# Altium project Prototype_2_Main_Board.PrjPcb (part 1 of 2)
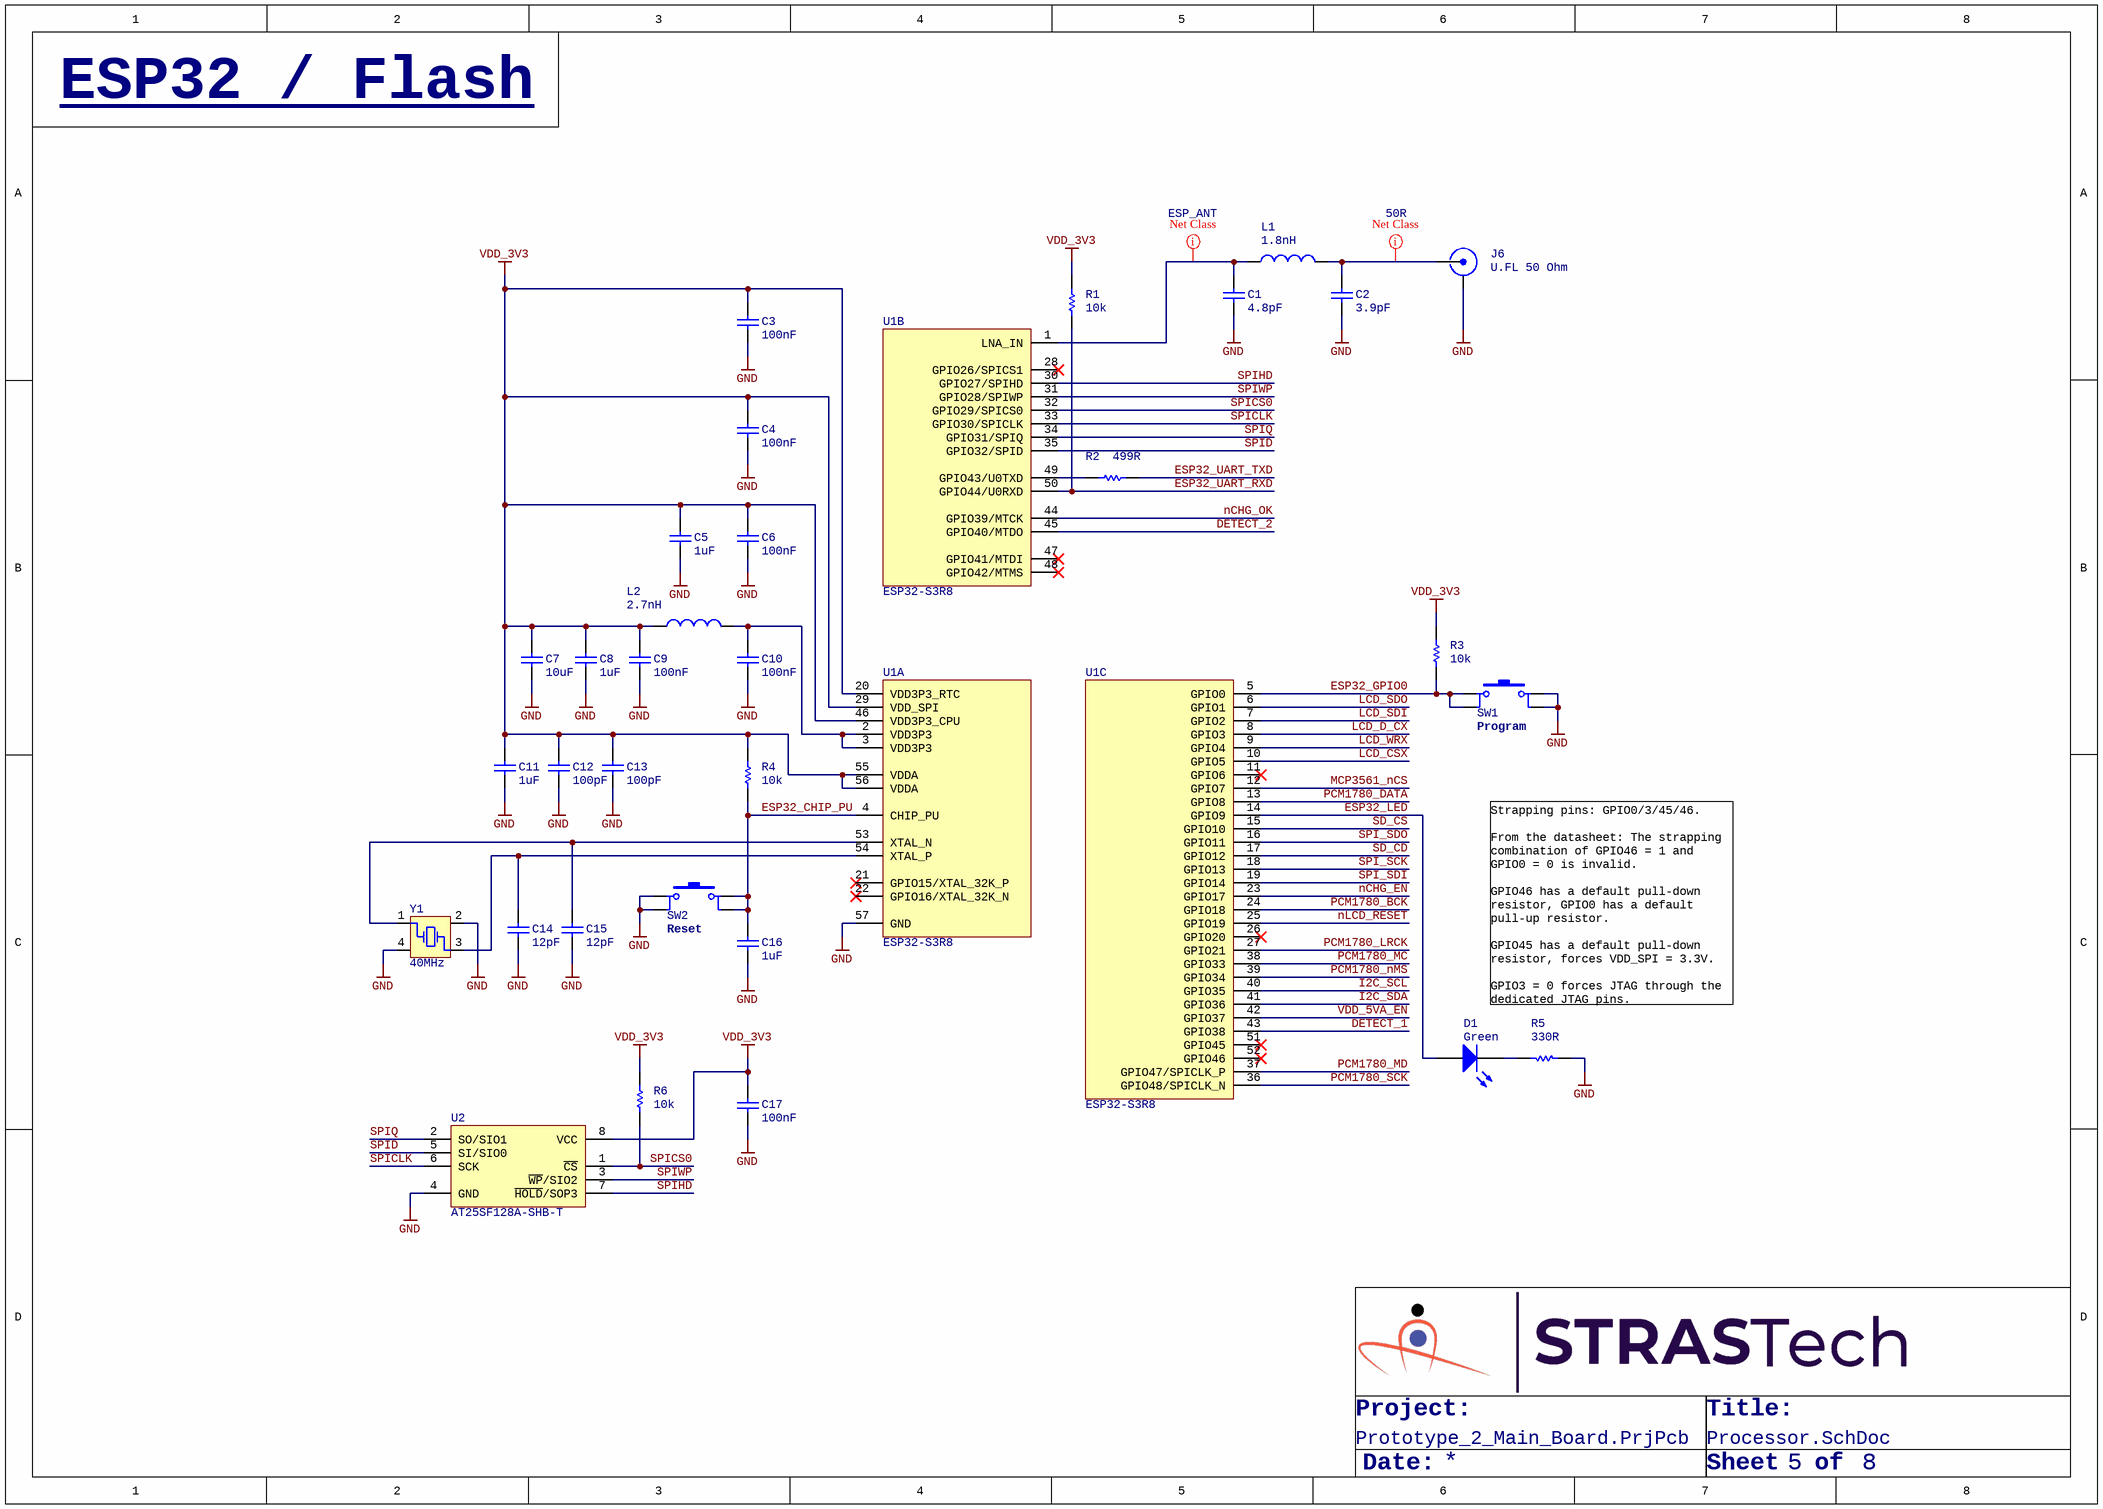
[diagram p0: Processor.SchDoc]
8 sheets, 237 parts. Net scope: global (net labels, ports and power ports of the same name join across sheets).
Board file: Main_Board.PcbDoc
Sheets:
  Processor.SchDoc
  USB_Serial.SchDoc
  Load_Cell_Biasing.SchDoc
  Load_Cell_Acquisition.SchDoc
  Inertial_Measurement_RTC.SchDoc
  Peripherals_Main_Board.SchDoc
  Regulation_Charging.SchDoc
  ShinStrap_Interface.SchDoc

## Sheet Processor.SchDoc
size A3; Organization: Altium Limited; Address1: L3, 12a Rodborough Rd; Address2: Frenchs Forest; Address3: NSW; Address4: Australia 2086; DocumentNumber: 5; SheetNumber: 5; SheetTotal: 8

### Parts
C1  4.8pF  [Cap,SMD,0402]
C2  3.9pF  [Cap,SMD,0402]
C3  100nF  [Cap,SMD,0402]
C4  100nF  [Cap,SMD,0402]
C5  1uF  [Cap,SMD,0402]
C6  100nF  [Cap,SMD,0402]
C7  10uF  [Cap,SMD,0402]
C8  1uF  [Cap,SMD,0402]
C9  100nF  [Cap,SMD,0402]
C10  100nF  [Cap,SMD,0402]
C11  1uF  [Cap,SMD,0402]
C12  100pF  [Cap,SMD,0402]
C13  100pF  [Cap,SMD,0402]
C14  12pF  [Cap,SMD,0402]
C15  12pF  [Cap,SMD,0402]
C16  1uF  [Cap,SMD,0402]
C17  100nF  [Cap,SMD,0402]
D1  Green  [LED,0603]
J6  U.FL 50 Ohm  [CONN,UFL,50Ohm,SMD]
L1  1.8nH  [ind,0402]
L2  2.7nH  [ind,0402]
R1  10k  [RES,0402]
R2  499R  [RES,0402]
R3  10k  [RES,0402]
R4  10k  [RES,0402]
R5  330R  [RES,0402]
R6  10k  [RES,0402]
SW1  Switch  [Switch,Tactile,Micro,SPST-NO,SMD]  (value not drawn)
SW2  Switch  [Switch,Tactile,Micro,SPST-NO,SMD]  (value not drawn)
U1  ESP32-S3R8  [IC,QFN-56,7X7,P0.4MM]  (parts A,B,C of 3)
U2  AT25SF128A-SHB-T  [IC,SOIC-8,1.27mm,W5.28]
Y1  40MHz  [XTAL,SMD,4 Pin,2x2.5mm]

### Nets
GND: C1.1 C2.1 C3.1 C4.1 C5.1 C6.1 C7.1 C8.1 C9.1 C10.1 C11.1 C12.1 C13.1 C14.2 C15.2 C16.1 C17.1 J6.2 R5.1 SW1.3 SW1.4 SW2.1 SW2.2 U1.57(GND) U2.4(GND) Y1.2(GND) Y1.4(GND)
VDD_3V3: C3.2 C4.2 C5.2 C6.2 C7.2 C8.2 C9.2 C11.2 C12.2 C13.2 C17.2 L2.1 R1.2 R3.1 R4.1 R6.2 U1.20(VDD3P3_RTC) U1.29(VDD_SPI) U1.46(VDD3P3_CPU) U1.55(VDDA) U1.56(VDDA) U2.8(VCC)
DETECT_1: U1.43(GPIO38)
DETECT_2: U1.45(GPIO40/MTDO)
ESP32_CHIP_PU: C16.2 R4.2 SW2.3 SW2.4 U1.4(CHIP_PU)
ESP32_GPIO0: R3.2 SW1.1 SW1.2 U1.5(GPIO0)
ESP32_LED: D1.1(A) U1.14(GPIO9)
ESP32_UART_RXD: R1.1 U1.50(GPIO44/U0RXD)
ESP32_UART_TXD: R2.2
I2C_SCL: U1.40(GPIO35)
I2C_SDA: U1.41(GPIO36)
LCD_CSX: U1.10(GPIO5)
LCD_D_CX: U1.8(GPIO3)
LCD_SDI: U1.7(GPIO2)
LCD_SDO: U1.6(GPIO1)
LCD_WRX: U1.9(GPIO4)
MCP3561_nCS: U1.12(GPIO7)
nCHG_EN: U1.23(GPIO17)
nCHG_OK: U1.44(GPIO39/MTCK)
nLCD_RESET: U1.25(GPIO19)
PCM1780_BCK: U1.24(GPIO18)
PCM1780_DATA: U1.13(GPIO8)
PCM1780_LRCK: U1.27(GPIO21)
PCM1780_MC: U1.38(GPIO33)
PCM1780_MD: U1.37(GPIO47/SPICLK_P)
PCM1780_nMS: U1.39(GPIO34)
PCM1780_SCK: U1.36(GPIO48/SPICLK_N)
SD_CD: U1.17(GPIO12)
SD_CS: U1.15(GPIO10)
SPI_SCK: U1.18(GPIO13)
SPI_SDI: U1.19(GPIO14)
SPI_SDO: U1.16(GPIO11)
SPICLK: U1.33(GPIO30/SPICLK) U2.6(SCK)
SPICS0: R6.1 U1.32(GPIO29/SPICS0) U2.1(~{CS})
SPID: U1.35(GPIO32/SPID) U2.5(SI/SIO0)
SPIHD: U1.30(GPIO27/SPIHD) U2.7(~{HOLD}/SOP3)
SPIQ: U1.34(GPIO31/SPIQ) U2.2(SO/SIO1)
SPIWP: U1.31(GPIO28/SPIWP) U2.3(~{WP}/SIO2)
VDD_5VA_EN: U1.42(GPIO37)
NetC1_2: C1.2 L1.1 U1.1(LNA_IN)
NetC2_2: C2.2 J6.1 L1.2
NetC10_2: C10.2 L2.2 U1.2(VDD3P3) U1.3(VDD3P3)
NetC14_1: C14.1 U1.54(XTAL_P) Y1.3(OSC2)
NetC15_1: C15.1 U1.53(XTAL_N) Y1.1(OSC1)
NetD1_2: D1.2(K) R5.2
NetR2_1: R2.1 U1.49(GPIO43/U0TXD)

Not connected (* = marked no-connect by the designer): U1 11(GPIO6)* 21(GPIO15/XTAL_32K_P)* 22(GPIO16/XTAL_32K_N)* 26(GPIO20)* 28(GPIO26/SPICS1)* 47(GPIO41/MTDI)* 48(GPIO42/MTMS)* 51(GPIO45)* 52(GPIO46)*

### Layout directives
net class ESP_ANT: NetC1_2
net class 50R: NetC2_2

### Notes on the sheet
- ESP32 / Flash
- (near SW1) Program
- (near SW2) Reset
- Strapping pins: GPIO0/3/45/46.
  From the datasheet: The strapping combination of GPIO46 = 1 and GPIO0 = 0 is invalid.
  GPIO46 has a default pull-down resistor, GPIO0 has a default pull-up resistor.
  GPIO45 has a default pull-down resistor, forces VDD_SPI = 3.3V.
  GPIO3 = 0 forces JTAG through the dedicated JTAG pins.
- Project:
- Title:
- Date:
- Sheet
- of
- Title
- Size:
- A3
- Revision:
- Design By:

### Library data of the parts
C1 = CAP,Cer,4.8pF,50VDC,C0G/NP0,0402: 4.8 pF ±0.25pF 50V Ceramic Capacitor C0G, NP0 0402 (1005 Metric); Vendor Part Number: 490-17481-1-ND; Manufacturer: Murata Electronics; Manufacturer Part Number: GCQ1555C1H4R8CB01D; Vendor: Digikey; HelpURL: https://search.murata.co.jp/Ceramy/image/img/A01X/G101/ENG/GCQ1555C1H4R8CB01-01.pdf; CreatedBy: Judd Foster
C2 = CAP,Cer,3.9pF,50VDC,C0G/NP0,0402: 3.9 pF ±0.1pF 50V Ceramic Capacitor C0G, NP0 0402 (1005 Metric); Vendor Part Number: 399-CBR04C399B5GACCT-ND; Manufacturer: KEMET; Manufacturer Part Number: CBR04C399B5GAC; Vendor: Digikey; HelpURL: https://api.kemet.com/component-edge/download/datasheet/CBR04C399B5GAC.pdf; CreatedBy: Judd Foster
C3 C4 C6 C9 C10 C17 = CAP,Cer,100nF,25VDC,X7R,0402: 0.1µF ±10% 25V Ceramic Capacitor X7R 0402 (1005 Metric); Vendor Part Number: 490-14603-1-ND; Manufacturer: Murata Electronics; Manufacturer Part Number: GRM155R71E104KE14J; Vendor: Digikey; HelpURL: https://search.murata.co.jp/Ceramy/image/img/A01X/G101/ENG/GRM155R71E104KE14-01.pdf; CreatedBy: Judd Foster
C5 C8 C11 = CAP,Cer,1uF,35VDC,X5R,0402: 1 µF ±10% 35V Ceramic Capacitor X5R 0402 (1005 Metric); Vendor Part Number: 445-9073-1-ND; Manufacturer: TDK Corporation; Manufacturer Part Number: C1005X5R1V105K050BC; Vendor: Digikey; HelpURL: https://product.tdk.com/info/en/catalog/datasheets/mlcc_commercial_general_en.pdf?ref_disty=digikey; CreatedBy: Judd Foster
C7 = CAP,Cer,10uF,10VDC,X5R,0402: 10 µF ±20% 10V Ceramic Capacitor X5R 0402 (1005 Metric); Vendor Part Number: 1276-1450-1-ND; Manufacturer: Samsung Electro-Mechanics; Manufacturer Part Number: CL05A106MP5NUNC; Vendor: Digikey; HelpURL: https://media.digikey.com/pdf/Data%20Sheets/Samsung%20PDFs/CL05A106MP5NUNC_Spec.pdf; CreatedBy: Judd Foster
C12 C13 = CAP,Cer,100pF,50VDC,C0G/NP0,0402: 100pF ±5% 50V Ceramic Capacitor C0G, NP0 0402 (1005 Metric); Vendor Part Number: 490-10669-1-ND; Manufacturer: Murata Electronics; Manufacturer Part Number: GCM1555C1H101JA16D; Vendor: Digikey; HelpURL: https://www.murata.com/~/media/webrenewal/support/library/catalog/products/capacitor/mlcc/c03e.ashx?la=en-us; CreatedBy: Judd Foster
C14 C15 = CAP,Cer,12pF,50VDC,C0G/NP0,0402: 12pF ±5% 50V Ceramic Capacitor C0G, NP0 0402 (1005 Metric); Vendor Part Number: 311-1016-1-ND; Manufacturer: Yageo; Manufacturer Part Number: CC0402JRNPO9BN120; Vendor: Digikey; HelpURL: https://www.yageo.com/upload/media/product/productsearch/datasheet/mlcc/UPY-GP_NP0_16V-to-50V_18.pdf; CreatedBy: Judd Foster
C16 = CAP,Cer,1uF,6.3VDC,X5R,0402: 1µF ±20% 6.3V Ceramic Capacitor X5R 0402 (1005 Metric); Vendor Part Number: 1276-1235-1-ND; Manufacturer: Samsung Electro-Mechanics; Manufacturer Part Number: CL05A105MQ5NNNC; Vendor: Digikey; HelpURL: https://media.digikey.com/pdf/Data%20Sheets/Samsung%20PDFs/CL_Series_MLCC_ds.pdf; CreatedBy: Judd Foster
D1 = LED,Green,SMD,0603: Green 530nm LED Indication - Discrete 3V 0603 (1608 Metric); Manufacturer: Stanley Electric Co; Manufacturer Part Number: THG1111C-0005-TR; Vendor Part Number: 404-1286-1-ND; Vendor: Digikey; CreatedBy: Judd Foster; HelpURL: http://www.stanley-components.com/php/downloaddatafile.php?rp=0,THG1111C-0005_e.pdf
J6 = Conn,RF,U.FL,50 Ohm,SMD: U.FL (UMCC) Connector Receptacle, Male Pin 50Ohm Surface Mount Solder; Manufacturer: Hirose Electric Co Ltd; Manufacturer Part Number: U.FL-R-SMT-1(40); Vendor Part Number: H125761CT-ND; Vendor: Digikey; CreatedBy: Judd Foster; HelpURL: https://www.hirose.com/product/document?clcode=CL0311-0300-2-40&productname=HRMP-U.FLJ(40)&series=U.FL&documenttype=Catalog&lang=en&documentid=D31697_en
L1 = IND,1.8nH,900mA,Multilayer,0402: 1.8 nH Unshielded Multilayer Inductor 900 mA 100mOhm Max 0402 (1005 Metric); Vendor Part Number: 490-1076-1-ND; Manufacturer: Murata Electronics; Manufacturer Part Number: LQG15HN1N8S02D; Vendor: Digikey; HelpURL: https://search.murata.co.jp/Ceramy/image/img/P02/JELF243B-0009.pdf; CreatedBy: Judd Foster
L2 = IND,2.7nH,800mA,Multilayer,0402: 2.7nH Unshielded Multilayer Inductor 800mA 150mOhm Max 0402 (1005 Metric); Vendor Part Number: 490-2615-1-ND; Manufacturer: Murata Electronics; Manufacturer Part Number: LQG15HS2N7S02D; Vendor: Digikey; HelpURL: https://psearch.en.murata.com/inductor/product/LQG15HS2N7S02_.pdf; CreatedBy: Judd Foster
R1 R3 R4 R6 = RES,10k,5%,0.063W,0402: 10 kOhms ±5% 0.063W, 1/16W Chip Resistor 0402 (1005 Metric) Automotive AEC-Q200 Thick Film; Vendor Part Number: RMCF0402JT10K0CT-ND; Manufacturer: Stackpole Electronics Inc; Manufacturer Part Number: RMCF0402JT10K0; Vendor: DIgikey; HelpURL: https://www.seielect.com/catalog/sei-rmcf_rmcp.pdf; CreatedBy: Judd Foster
R2 = RES,499R,1%,0.063W,0402: 499 Ohms ±1% 0.063W, 1/16W Chip Resistor 0402 (1005 Metric) Automotive AEC-Q200 Thick Film; Manufacturer: Stackpole Electronics Inc; Manufacturer Part Number: RMCF0402FT499R; Vendor Part Number: RMCF0402FT499RCT-ND; Vendor: Digikey; CreatedBy: Judd Foster; HelpURL: https://www.seielect.com/catalog/sei-rmcf_rmcp.pdf
R5 = RES,330R,5%,0.063W,0402: 330 Ohms ±5% 0.063W, 1/16W Chip Resistor 0402 (1005 Metric) Automotive AEC-Q200 Thick Film; Manufacturer: Stackpole Electronics Inc; Manufacturer Part Number: RMCF0402JT330R; Vendor Part Number: RMCF0402JT330RCT-ND; Vendor: Digikey; CreatedBy: Judd Foster; HelpURL: https://www.seielect.com/catalog/sei-rmcf_rmcp.pdf
SW1 SW2 = Switch,Tactile,SPST-NO,SMD,H1.5: Tactile Switch SPST-NO Top Actuated Surface Mount; Manufacturer: C&K; Manufacturer Part Number: PTS525SM15SMTR2 LFS; Vendor Part Number: CKN9104CT-ND; Vendor: Digikey; CreatedBy: Judd Foster; HelpURL: https://www.ckswitches.com/media/1467/pts525.pdf
U1 = ESP32-S3R8: IC RF TxRx + MCU Bluetooth, WiFi 802.11b/g/n, Bluetooth v5.0 2.412GHz ~ 2.484GHz 56-VFQFN Exposed Pad; Manufacturer: Espressif Systems; Vendor Part Number: 1904-ESP32-S3R8-ND; Vendor: Digikey; CreatedBy: Judd Foster; HelpURL: https://www.espressif.com/sites/default/files/documentation/esp32-s3_datasheet_en.pdf; Manufacturer Part Number: ESP32-S3R8
U2 = AT25SF128A-SHB-T: FLASH - NOR Memory IC 128Mb (16M x 8) SPI - Quad I/O 133 MHz 8-SOIC; Manufacturer: Adesto Technologies; Vendor Part Number: 1265-1348-1-ND; Vendor: Digikey; CreatedBy: Judd Foster; HelpURL: https://www.dialog-semiconductor.com/sites/default/files/2021-02/DS-AT25SF128A-168.pdf; Manufacturer Part Number: AT25SF128A-SHB-T
Y1 = XTAL,40MHz,12pF,SMD: 40 MHz ±7ppm Crystal 12pF 25 Ohms 4-SMD, No Lead; Manufacturer: Hosonic Electronic Co., Ltd; Manufacturer Part Number: E2SB40E000104E; Vendor Part Number: 3186-E2SB40E000104ECT-ND; Vendor: Digikey; CreatedBy: Judd Foster; HelpURL: https://ecsxtal.com/store/pdf/ECS-33B.pdf

## Sheet USB_Serial.SchDoc
size A3; Organization: Altium Limited; Address1: L3, 12a Rodborough Rd; Address2: Frenchs Forest; Address3: NSW; Address4: Australia 2086; DocumentNumber: 8; SheetNumber: 8; SheetTotal: 8
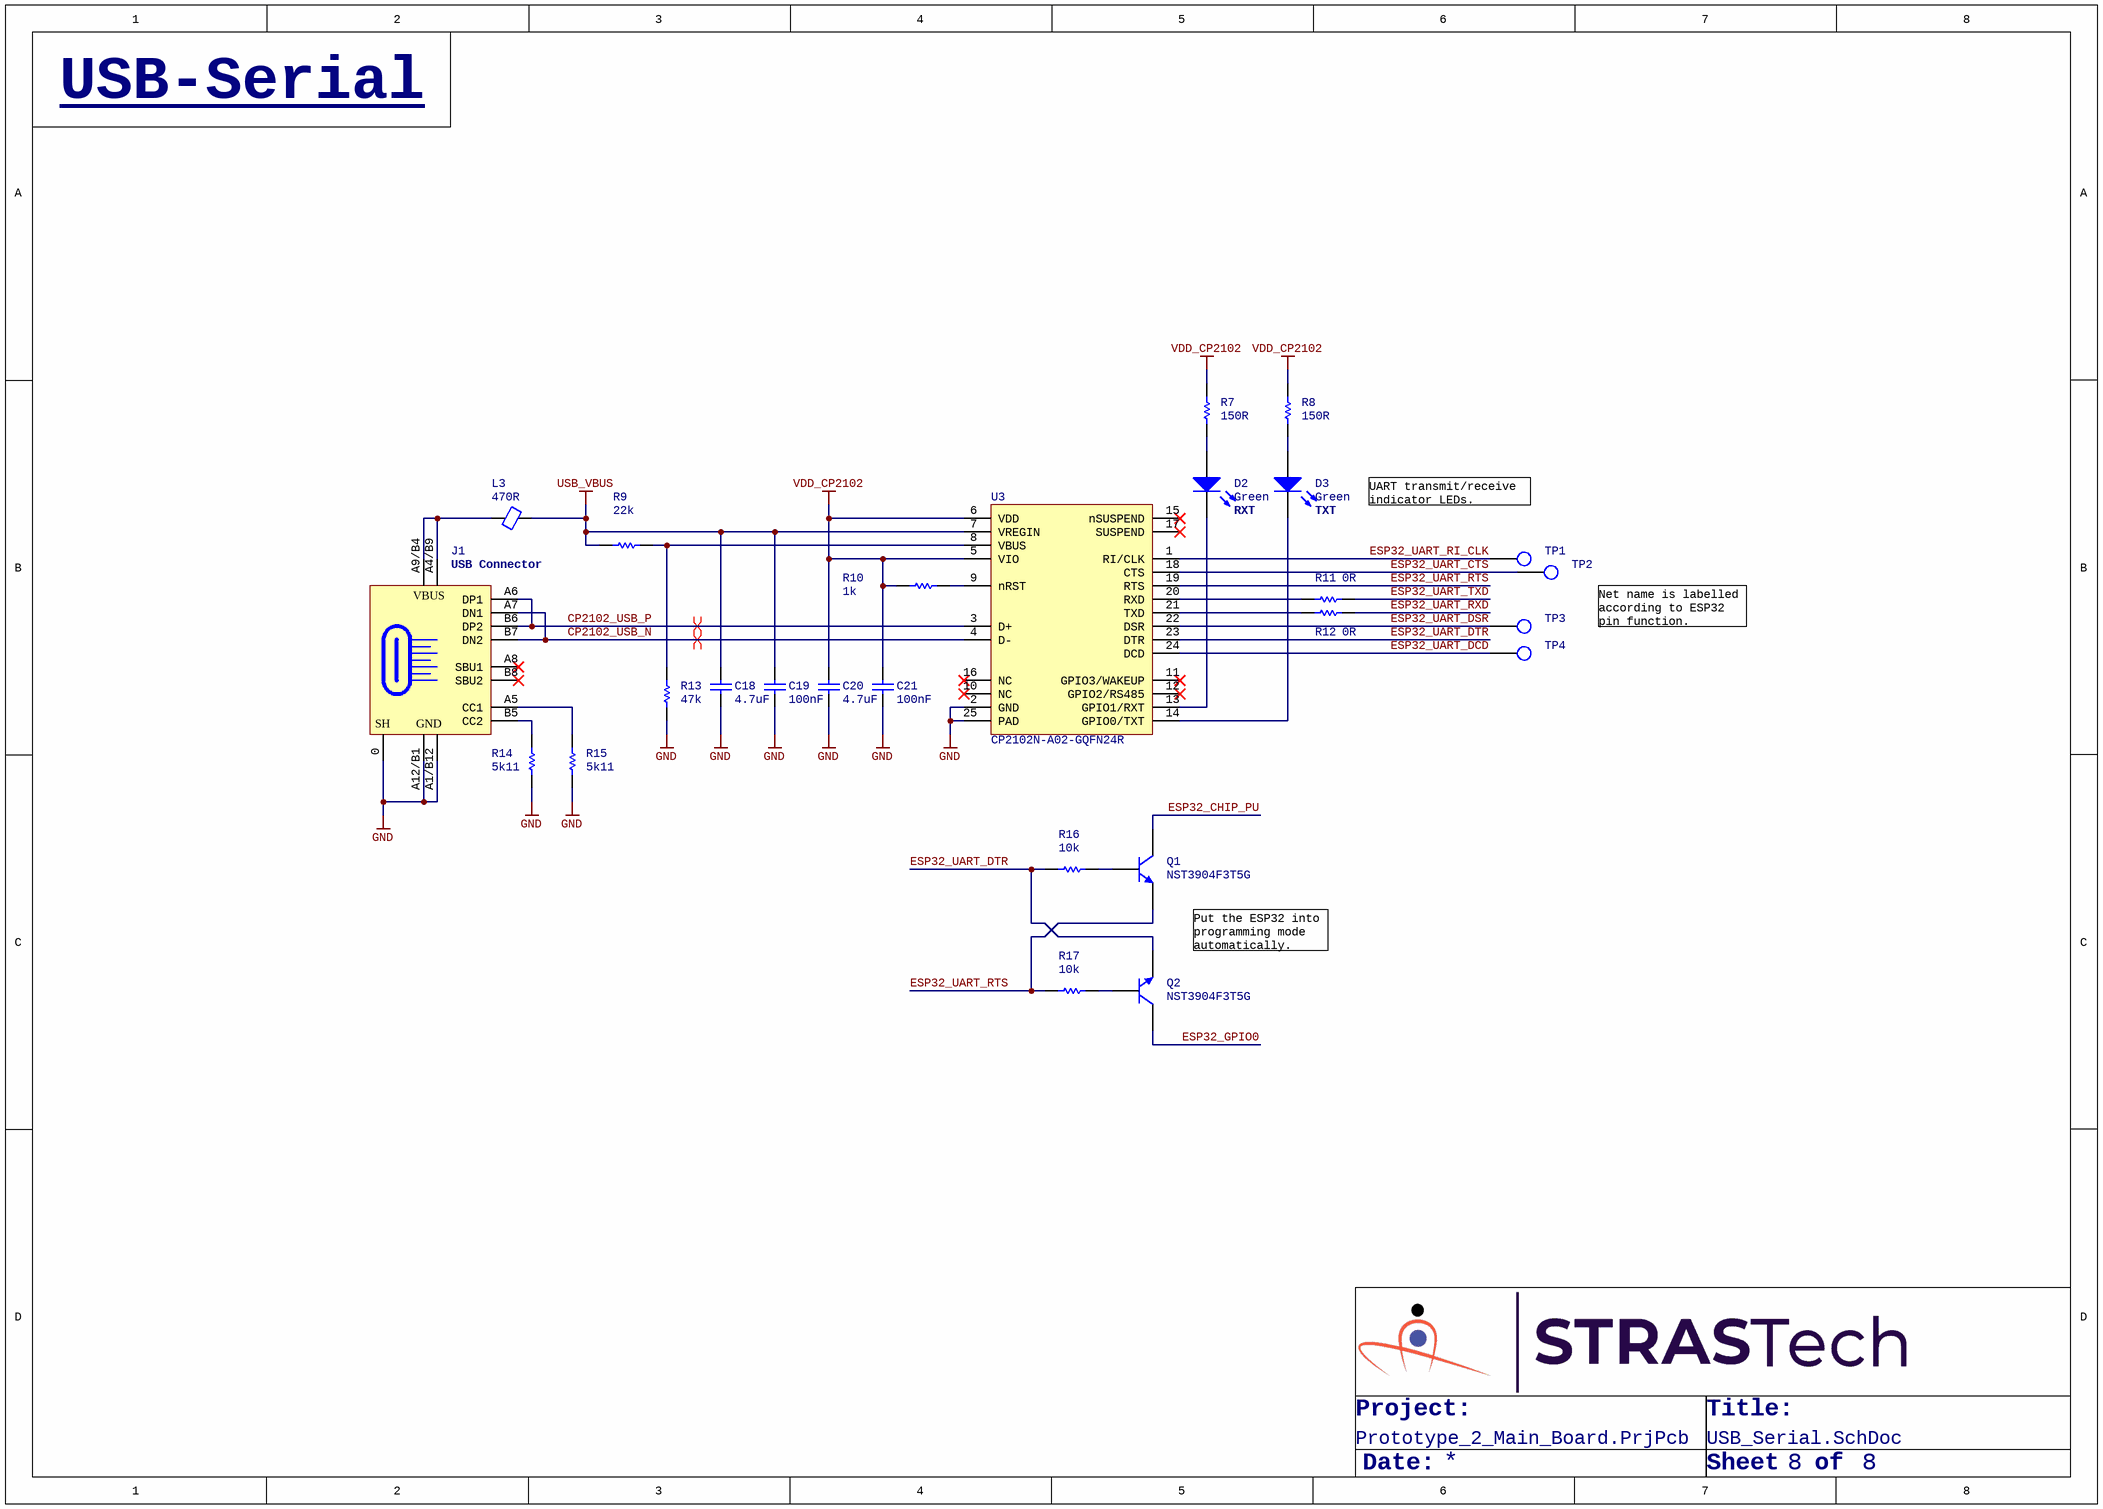
[diagram p1: USB_Serial.SchDoc]

### Parts
C18  4.7uF  [Cap,SMD,0402]
C19  100nF  [Cap,SMD,0402]
C20  4.7uF  [Cap,SMD,0402]
C21  100nF  [Cap,SMD,0402]
D2  Green  [LED,0603]
D3  Green  [LED,0603]
J1  USB  [CONN,USB_C,SMD]  (value not drawn)
L3  470R  [IND,0402]
Q1  NST3904F3T5G  [SOT1123]
Q2  NST3904F3T5G  [SOT1123]
R7  150R  [RES,0402]
R8  150R  [RES,0402]
R9  22k  [RES,0402]
R10  1k  [RES,0402]
R11  0R  [RES,0402]
R12  0R  [RES,0402]
R13  47k  [RES,0402]
R14  5k11  [RES,0402]
R15  5k11  [RES,0402]
R16  10k  [RES,0402]
R17  10k  [RES,0402]
TP1  TESTPOINT  [testpoint,smd,round,1mm]  (value not drawn)
TP2  TESTPOINT  [testpoint,smd,round,1mm]  (value not drawn)
TP3  TESTPOINT  [testpoint,smd,round,1mm]  (value not drawn)
TP4  TESTPOINT  [testpoint,smd,round,1mm]  (value not drawn)
U3  CP2102N-A02-GQFN24R  [IC,VQFN-24,THERMAL,4x4]

### Nets
GND: C18.1 C19.1 C20.1 C21.1 J1.0(SHIELD) J1.A1/B12(GND) J1.A12/B1(GND) R13.1 R14.1 R15.1 U3.2(GND) U3.25(PAD)
USB_VBUS: C18.2 C19.2 L3.2 R9.1 U3.7(VREGIN)
VDD_CP2102: C20.2 C21.2 R7.2 R8.2 R10.2 U3.5(VIO) U3.6(VDD)
CP2102_USB_N: J1.A7(DN1) J1.B7(DN2) U3.4(D-)
CP2102_USB_P: J1.A6(DP1) J1.B6(DP2) U3.3(D+)
ESP32_CHIP_PU: Q1.3(C)
ESP32_GPIO0: Q2.3(C)
ESP32_UART_CTS: TP2.1(TP) U3.18(CTS)
ESP32_UART_DCD: TP4.1(TP) U3.24(DCD)
ESP32_UART_DSR: TP3.1(TP) U3.22(DSR)
ESP32_UART_DTR: Q2.2(E) R16.2 U3.23(DTR)
ESP32_UART_RI_CLK: TP1.1(TP) U3.1(RI/CLK)
ESP32_UART_RTS: Q1.2(E) R17.2 U3.19(RTS)
ESP32_UART_RXD: R12.2
ESP32_UART_TXD: R11.2
NetD2_1: D2.1(A) R7.1
NetD2_2: D2.2(K) U3.13(GPIO1/RXT)
NetD3_1: D3.1(A) R8.1
NetD3_2: D3.2(K) U3.14(GPIO0/TXT)
NetJ1_A4/B9: J1.A4/B9(VBUS) J1.A9/B4(VBUS) L3.1
NetJ1_A5: J1.A5(CC1) R15.2
NetJ1_B5: J1.B5(CC2) R14.2
NetQ1_1: Q1.1(B) R16.1
NetQ2_1: Q2.1(B) R17.1
NetR9_2: R9.2 R13.2 U3.8(VBUS)
NetR10_1: R10.1 U3.9(nRST)
NetR11_1: R11.1 U3.20(RXD)
NetR12_1: R12.1 U3.21(TXD)

Not connected (* = marked no-connect by the designer): J1 A8(SBU1)* B8(SBU2)*; U3 10(NC)* 11(GPIO3/WAKEUP)* 12(GPIO2/RS485)* 15(nSUSPEND)* 16(NC)* 17(SUSPEND)*

### Layout directives
differential pair: CP2102_USB_N, CP2102_USB_P

### Notes on the sheet
- USB-Serial
- RXT
- (near D3) TXT
- UART transmit/receive indicator LEDs.
- (near J1) USB Connector
- Net name is labelled according to ESP32 pin function.
- Put the ESP32 into programming mode automatically.
- Project:
- Title:
- Date:
- Sheet
- of
- Title
- Size:
- A3
- Revision:
- Design By:
- (in symbol Conn,USB_C,SMD) SH

### Library data of the parts
C18 C20 = CAP,Cer,4.7uF,16VDC,X5R,0402: 4.7 µF ±20% 16V Ceramic Capacitor X5R 0402 (1005 Metric); Vendor Part Number: 478-10788-1-ND; Manufacturer: AVX Corporation; Manufacturer Part Number: 0402YD475MAT2A; Vendor: Digikey; HelpURL: https://datasheets.avx.com/cx5r.pdf; CreatedBy: Judd Foster
C19 C21 = CAP,Cer,100nF,25VDC,X7R,0402: as C3 on sheet Processor; HelpURL: https://search.murata.co.jp/Ceramy/image/img/A01X/G101/ENG/GRM155R71E104KE14-01.pdf; CreatedBy: Judd Foster
D2 D3 = LED,Green,SMD,0603: as D1 on sheet Processor; CreatedBy: Judd Foster; HelpURL: http://www.stanley-components.com/php/downloaddatafile.php?rp=0,THG1111C-0005_e.pdf
J1 = Conn,USB_C,SMD: USB-C (USB TYPE-C) USB 2.0 Receptacle Connector 24 (16+8 Dummy) Position Surface Mount, Right Angle; Manufacturer: GCT; Manufacturer Part Number: USB4110-GF-A; Vendor Part Number: 2073-USB4110-GF-A-1-ND; Vendor: Digikey; CreatedBy: Judd Foster; HelpURL: https://gct.co/files/drawings/usb4110.pdf
L3 = Ferrite,470R@100MHz,0402: 470 Ohms @ 100 MHz 1 Power Line Ferrite Bead 0402 (1005 Metric) 1A 200mOhm; Vendor Part Number: 490-10662-1-ND; Manufacturer: Murata Electronics; Manufacturer Part Number: BLM15PX471SN1D; Vendor: Digikey; HelpURL: https://www.murata.com/en-us/products/productdata/8796740059166/ENFA0018.pdf; CreatedBy: Judd Foster
Q1 Q2 = Trans,NPN,40V,200mA,SOT1123: Bipolar (BJT) Transistor NPN 40 V 200 mA 200MHz 290 mW Surface Mount SOT-1123; Manufacturer: ON Semiconductor; Vendor Part Number: NST3904F3T5GOSCT-ND; Vendor: Digikey; CreatedBy: Judd Foster; HelpURL: https://www.onsemi.com/pdf/datasheet/nst3904f3-d.pdf; Manufacturer Part Number: NST3904F3T5G
R7 R8 = RES,150R,1%,0.1W,0402: 150 Ohms ±1% 0.063W, 1/16W Chip Resistor 0402 (1005 Metric) Automotive AEC-Q200, Moisture Resistant Thick Film; Manufacturer: TE Connectivity Passive Product; Manufacturer Part Number: CRGCQ0402F150R; Vendor Part Number: A129617CT-ND; Vendor: Digikey; CreatedBy: Judd Foster; HelpURL: https://www.te.com/commerce/DocumentDelivery/DDEController?Action=srchrtrv&DocNm=1773204-3&DocType=DS&DocLang=English
R9 = RES,22k,1%,0.063W,0402: 22 kOhms ±1% 0.063W, 1/16W Chip Resistor 0402 (1005 Metric) Automotive AEC-Q200 Thick Film; Vendor Part Number: RMCF0402FT22K0CT-ND; Manufacturer: Stackpole Electronics Inc; Manufacturer Part Number: RMCF0402FT22K0; Vendor: DIgikey; HelpURL: https://www.seielect.com/catalog/sei-rmcf_rmcp.pdf; CreatedBy: Judd Foster
R10 = RES,1k,5%,0.063W,0402: 1 kOhms ±5% 0.063W, 1/16W Chip Resistor 0402 (1005 Metric) Automotive AEC-Q200 Thick Film; Vendor Part Number: RMCF0402JT1K00CT-ND; Manufacturer: Stackpole Electronics Inc; Manufacturer Part Number: RMCF0402JT1K00; Vendor: DIgikey; HelpURL: https://www.seielect.com/catalog/sei-rmcf_rmcp.pdf; CreatedBy: Judd Foster
R11 R12 = RES,0R0,0.1W,0402: 0 Ohms Jumper 0.1W, 1/10W Chip Resistor 0402 (1005 Metric) Automotive AEC-Q200 Thick Film; Manufacturer: Panasonic Electronic Components; Manufacturer Part Number: ERJ-2GE0R00X; Vendor Part Number: P0.0JCT-ND; Vendor: Digikey; CreatedBy: Judd Foster; HelpURL: https://industrial.panasonic.com/cdbs/www-data/pdf/RDA0000/AOA0000C301.pdf
R13 = RES,47k,1%,0.1W,0402: 47 kOhms ±1% 0.1W, 1/10W Chip Resistor 0402 (1005 Metric) Automotive AEC-Q200 Thick Film; Manufacturer: Panasonic Electronic Components; Manufacturer Part Number: ERJ-2RKF4702X; Vendor Part Number: P47.0KLCT-ND; Vendor: Digikey; CreatedBy: Judd Foster; HelpURL: https://industrial.panasonic.com/cdbs/www-data/pdf/RDA0000/AOA0000C304.pdf
R14 R15 = RES,5k11,1%,0.063W,0402: 5.11 kOhms ±1% 0.063W, 1/16W Chip Resistor 0402 (1005 Metric) Automotive AEC-Q200, Moisture Resistant Thick Film; Manufacturer: Yageo; Manufacturer Part Number: AC0402FR-075K11L; Vendor Part Number: 13-AC0402FR-075K11LCT-ND; Vendor: Digikey; CreatedBy: Judd Foster; HelpURL: https://www.yageo.com/upload/media/product/productsearch/datasheet/rchip/PYu-AC_51_RoHS_L_7.pdf
R16 R17 = RES,10k,5%,0.063W,0402: as R1 on sheet Processor; HelpURL: https://www.seielect.com/catalog/sei-rmcf_rmcp.pdf; CreatedBy: Judd Foster
TP1-TP4 = TESTPOINT: PCB Testpoint; CreatedBy: Judd Foster; HelpURL: N/A; Manufacturer: N/A; Manufacturer Part Number: N/A; Vendor: N/A; Vendor Part Number: N/A
U3 = CP2102N-A02-GQFN24R: USB Bridge, USB to UART USB 2.0 UART Interface 24-QFN (4x4); Manufacturer: Silicon Labs; Vendor Part Number: 336-5888-1-ND; Vendor: Digikey; CreatedBy: Judd Foster; HelpURL: https://www.silabs.com/documents/public/data-sheets/cp2102n-datasheet.pdf; Manufacturer Part Number: CP2102N-A02-GQFN24R

## Sheet Load_Cell_Biasing.SchDoc
size A3; Organization: Altium Limited; Address1: L3, 12a Rodborough Rd; Address2: Frenchs Forest; Address3: NSW; Address4: Australia 2086; DocumentNumber: 3; SheetNumber: 3; SheetTotal: 8
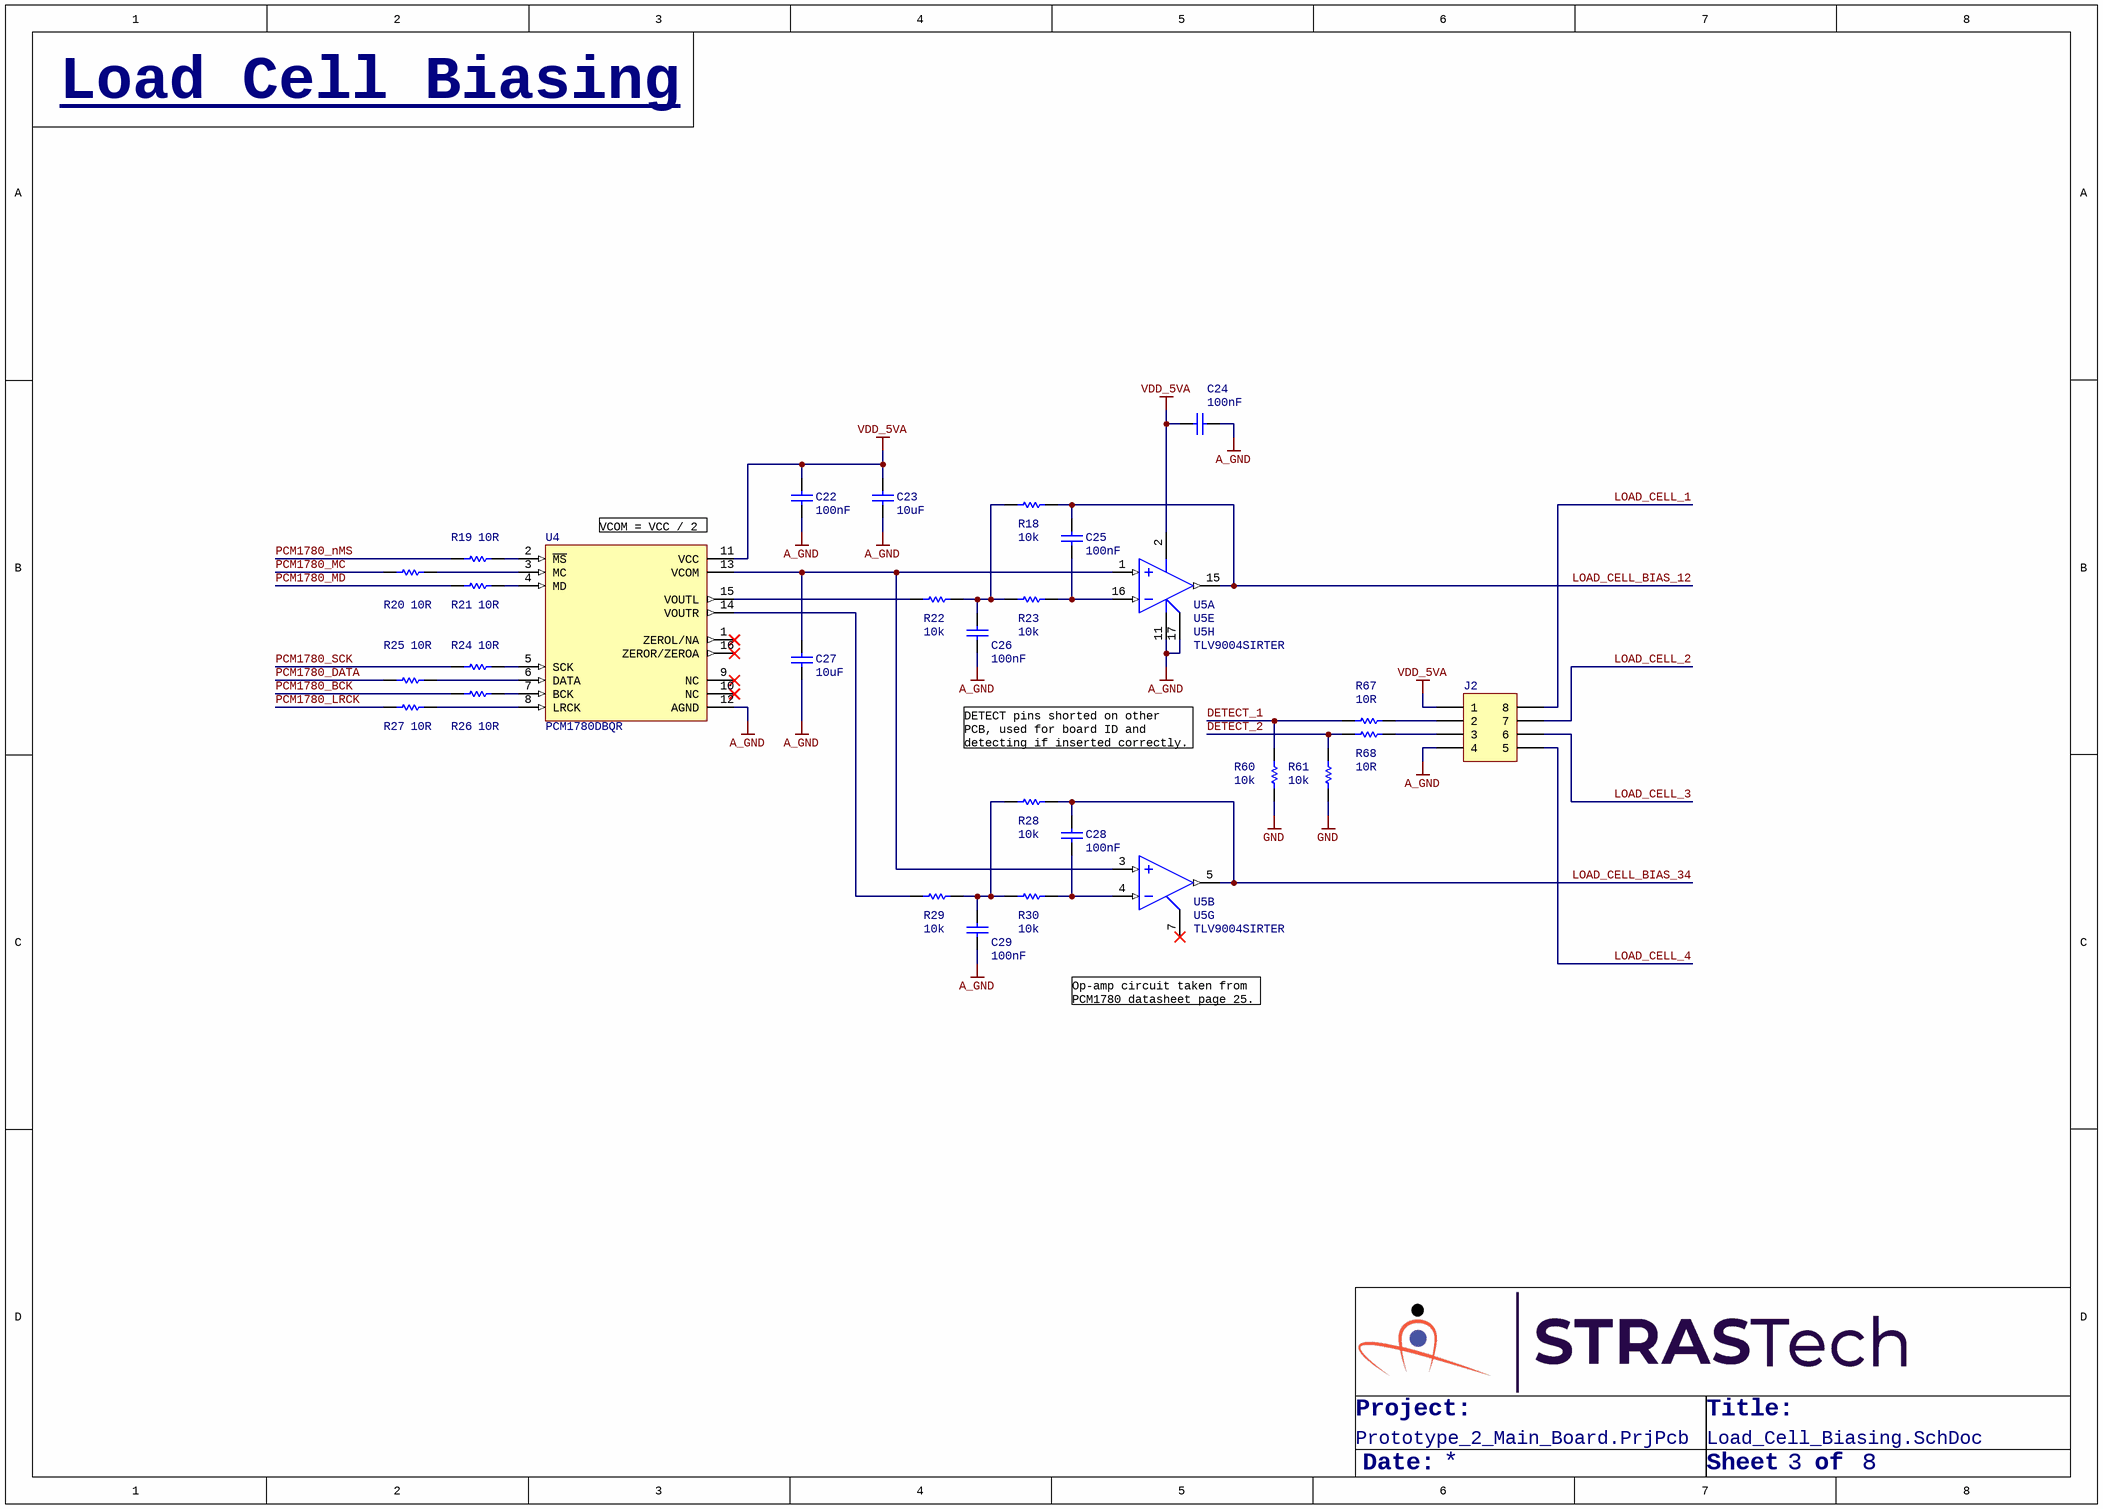
[diagram p2: Load_Cell_Biasing.SchDoc]

### Parts
C22  100nF  [Cap,SMD,0402]
C23  10uF  [Cap,SMD,0402]
C24  100nF  [Cap,SMD,0402]
C25  100nF  [Cap,SMD,0402]
C26  100nF  [Cap,SMD,0402]
C27  10uF  [Cap,SMD,0402]
C28  100nF  [Cap,SMD,0402]
C29  100nF  [Cap,SMD,0402]
J2  Conn,Spring,Piston,8Pos,Thru  [Conn,Spring,Piston,8Pos,Thru]  (value not drawn)
R18  10k  [RES,0402]
R19  10R  [RES,0402]
R20  10R  [RES,0402]
R21  10R  [RES,0402]
R22  10k  [RES,0402]
R23  10k  [RES,0402]
R24  10R  [RES,0402]
R25  10R  [RES,0402]
R26  10R  [RES,0402]
R27  10R  [RES,0402]
R28  10k  [RES,0402]
R29  10k  [RES,0402]
R30  10k  [RES,0402]
R60  10k  [RES,0402]
R61  10k  [RES,0402]
R67  10R  [RES,0402]
R68  10R  [RES,0402]
U4  PCM1780DBQR  [IC,TSSOP-16,W3.9,P0.635MM]
U5  TLV9004SIRTER  [IC,QFN-16,3x3]  (parts A,B,E,G,H of 8)

### Nets
A_GND: C22.1 C23.1 C24.1 C26.1 C27.2 C29.1 J2.4 U4.12(AGND) U5.11(V-) U5.17(PAD)
GND: R60.1 R61.1
VDD_5VA: C22.2 C23.2 C24.2 J2.1 U4.11(VCC) U5.2(V+)
DETECT_1: R60.2 R67.1
DETECT_2: R61.2 R68.1
LOAD_CELL_1: J2.8
LOAD_CELL_2: J2.7
LOAD_CELL_3: J2.6
LOAD_CELL_4: J2.5
LOAD_CELL_BIAS_12: C25.2 R18.1 U5.15(OUT1)
LOAD_CELL_BIAS_34: C28.2 R28.1 U5.5(OUT2)
PCM1780_BCK: R26.1
PCM1780_DATA: R25.1
PCM1780_LRCK: R27.1
PCM1780_MC: R20.1
PCM1780_MD: R21.1
PCM1780_nMS: R19.1
PCM1780_SCK: R24.1
NetC25_1: C25.1 R23.2 U5.16(IN1-)
NetC26_2: C26.2 R18.2 R22.2 R23.1
NetC27_1: C27.1 U4.13(VCOM) U5.1(IN1+) U5.3(IN2+)
NetC28_1: C28.1 R30.2 U5.4(IN2-)
NetC29_2: C29.2 R28.2 R29.2 R30.1
NetJ2_2: J2.2 R67.2
NetJ2_3: J2.3 R68.2
NetR19_2: R19.2 U4.2(~{MS})
NetR20_2: R20.2 U4.3(MC)
NetR21_2: R21.2 U4.4(MD)
NetR22_1: R22.1 U4.15(VOUTL)
NetR24_2: R24.2 U4.5(SCK)
NetR25_2: R25.2 U4.6(DATA)
NetR26_2: R26.2 U4.7(BCK)
NetR27_2: R27.2 U4.8(LRCK)
NetR29_1: R29.1 U4.14(VOUTR)

Not connected (* = marked no-connect by the designer): U4 1(ZEROL/NA)* 9(NC)* 10(NC)* 16(ZEROR/ZEROA)*; U5 7(~{SHDN}34)*

### Notes on the sheet
- Load Cell Biasing
- (near U4) VCOM = VCC / 2
- DETECT pins shorted on other PCB, used for board ID and detecting if inserted correctly.
- Op-amp circuit taken from PCM1780 datasheet page 25.
- Project:
- Title:
- Date:
- Sheet
- of
- Title
- Size:
- A3
- Revision:
- Design By:

### Library data of the parts
C22 C24-C26 C28 C29 = CAP,Cer,100nF,25VDC,X7R,0402: as C3 on sheet Processor; HelpURL: https://search.murata.co.jp/Ceramy/image/img/A01X/G101/ENG/GRM155R71E104KE14-01.pdf; CreatedBy: Judd Foster
C23 C27 = CAP,Cer,10uF,10VDC,X5R,0402: as C7 on sheet Processor; HelpURL: https://media.digikey.com/pdf/Data%20Sheets/Samsung%20PDFs/CL05A106MP5NUNC_Spec.pdf; CreatedBy: Judd Foster
J2 = Conn,Spring,Piston,8Pos,Thru: 8 Position Spring Piston Connector Through Hole; Manufacturer: Mill-Max Manufacturing Corp.; Manufacturer Part Number: 823-22-008-10-002101; Vendor Part Number: ED8177-08-ND; Vendor: Digikey; CreatedBy: Judd Foster; HelpURL: https://www.mill-max.com/catalog/download/2019-08%3A013.pdf
R18 R22 R23 R28-R30 R60 R61 = RES,10k,5%,0.063W,0402: as R1 on sheet Processor; HelpURL: https://www.seielect.com/catalog/sei-rmcf_rmcp.pdf; CreatedBy: Judd Foster
R19-R21 R24-R27 R67 R68 = RES,10R,1%,0.063W,0402: 10 Ohms ±1% 0.063W, 1/16W Chip Resistor 0402 (1005 Metric) Automotive AEC-Q200 Thick Film; Manufacturer: Panasonic Electronic Components; Manufacturer Part Number: ERJ-2RKF10R0X; Vendor Part Number: P10.0LCT-ND; Vendor: Digikey; CreatedBy: Judd Foster; HelpURL: https://industrial.panasonic.com/cdbs/www-data/pdf/RDA0000/AOA0000C304.pdf
U4 = PCM1780DBQR: DAC, Audio 24 b 200k I²S 16-SSOP; Manufacturer: Texas Instruments; Vendor Part Number: 296-41373-1-ND; Vendor: Digikey; Manufacturer Part Number: PCM1780DBQR; HelpURL: https://www.ti.com/general/docs/suppproductinfo.tsp?distId=10&gotoUrl=https%3A%2F%2Fwww.ti.com%2Flit%2Fgpn%2Fpcm1780; CreatedBy: Judd Foster
U5 = TLV9004SIRTER: General Purpose Amplifier 4 Circuit Rail-to-Rail 16-WQFN (3x3); Manufacturer: Texas Instruments; Vendor Part Number: 296-51829-1-ND; Vendor: Digikey; CreatedBy: Judd Foster; HelpURL: https://www.ti.com/general/docs/suppproductinfo.tsp?distId=10&gotoUrl=https%3A%2F%2Fwww.ti.com%2Flit%2Fgpn%2Ftlv9004; Manufacturer Part Number: TLV9004SIRTER

## Sheet Load_Cell_Acquisition.SchDoc
size A3; Organization: Altium Limited; Address1: L3, 12a Rodborough Rd; Address2: Frenchs Forest; Address3: NSW; Address4: Australia 2086; DocumentNumber: 2; SheetNumber: 2; SheetTotal: 8
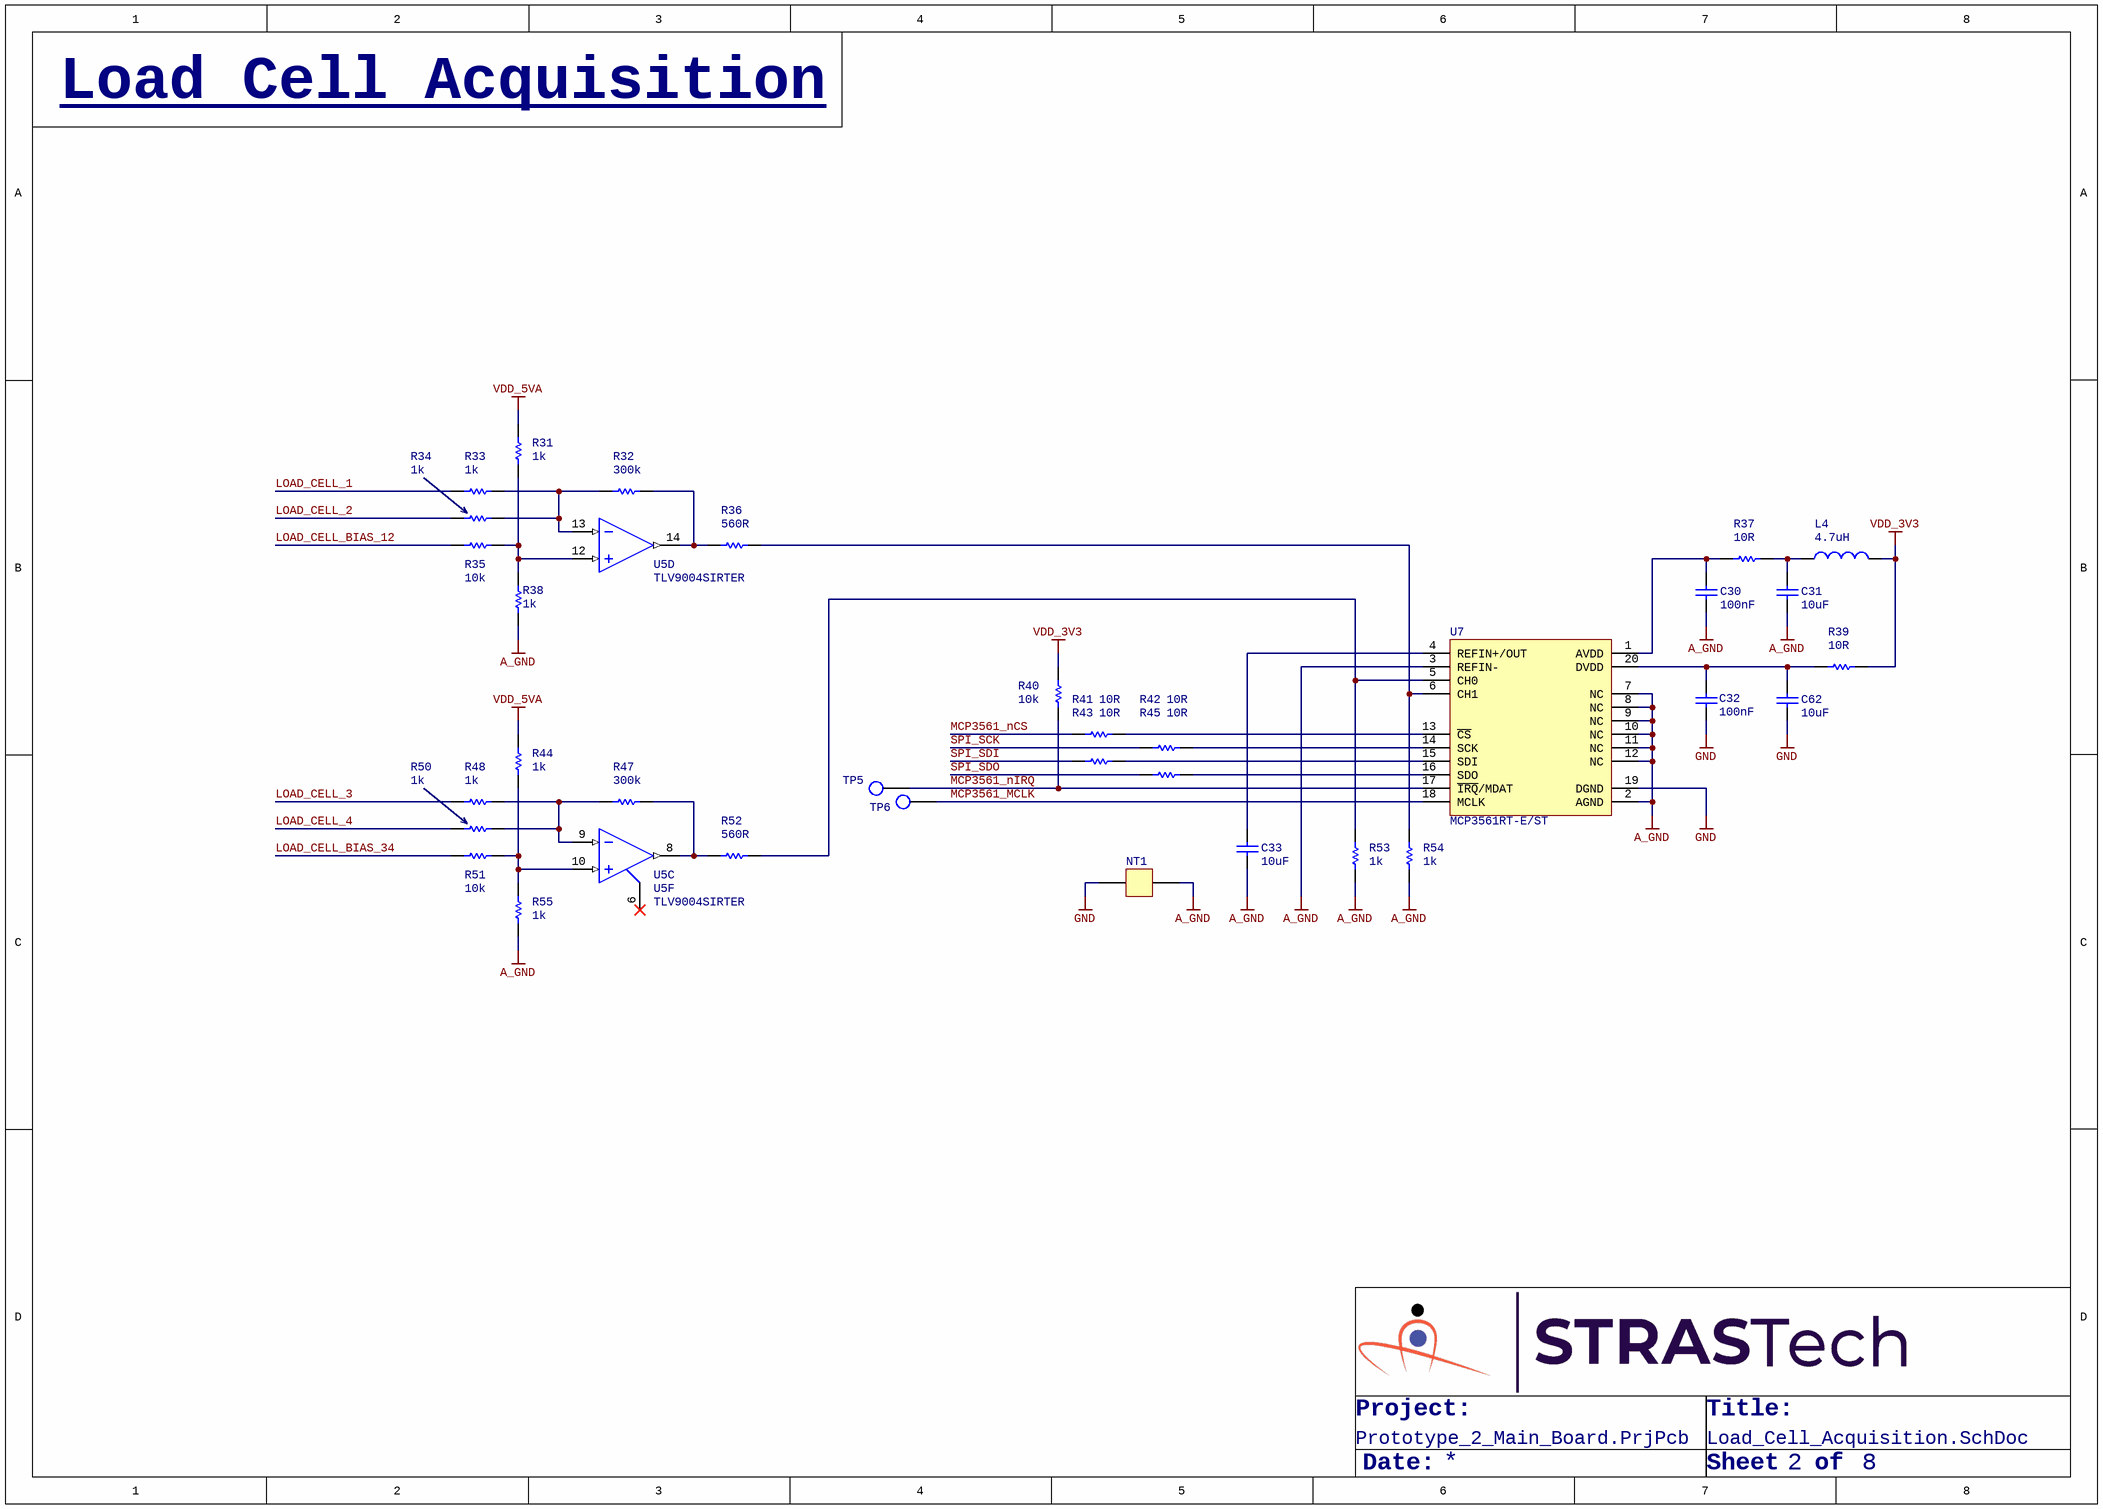
[diagram p3: Load_Cell_Acquisition.SchDoc]

### Parts
C30  100nF  [Cap,SMD,0402]
C31  10uF  [Cap,SMD,0402]
C32  100nF  [Cap,SMD,0402]
C33  10uF  [Cap,SMD,0402]
C62  10uF  [Cap,SMD,0402]
L4  4.7uH  [IND,0805]
NT1  Net Tie  [Net Tie,20x60mil]  (value not drawn)  (net tie, no BOM)
R31  1k  [RES,0402]
R32  300k  [RES,0402]
R33  1k  [RES,0402]
R34  1k  [RES,0402]
R35  10k  [RES,0402]
R36  560R  [RES,0402]
R37  10R  [RES,0402]
R38  1k  [RES,0402]
R39  10R  [RES,0402]
R40  10k  [RES,0402]
R41  10R  [RES,0402]
R42  10R  [RES,0402]
R43  10R  [RES,0402]
R44  1k  [RES,0402]
R45  10R  [RES,0402]
R47  300k  [RES,0402]
R48  1k  [RES,0402]
R50  1k  [RES,0402]
R51  10k  [RES,0402]
R52  560R  [RES,0402]
R53  1k  [RES,0402]
R54  1k  [RES,0402]
R55  1k  [RES,0402]
TP5  TESTPOINT  [testpoint,smd,round,1mm]  (value not drawn)
TP6  TESTPOINT  [testpoint,smd,round,1mm]  (value not drawn)
U5  TLV9004SIRTER  [IC,QFN-16,3x3]  (parts C,D,F of 8)
U7  MCP3561RT-E/ST  [IC,TSSOP-20,W4.4]

### Nets
A_GND: C30.1 C31.2 C33.1 NT1.2 R38.1 R53.2 R54.2 R55.1 U7.2(AGND) U7.3(REFIN-) U7.7(NC) U7.8(NC) U7.9(NC) U7.10(NC) U7.11(NC) U7.12(NC)
GND: C32.1 C62.2 NT1.1 U7.19(DGND)
VDD_3V3: L4.2 R39.2 R40.2
VDD_5VA: R31.2 R44.2
LOAD_CELL_1: R33.2
LOAD_CELL_2: R34.2
LOAD_CELL_3: R48.2
LOAD_CELL_4: R50.2
LOAD_CELL_BIAS_12: R35.1
LOAD_CELL_BIAS_34: R51.1
MCP3561_MCLK: TP6.1(TP) U7.18(MCLK)
MCP3561_nCS: R41.1
MCP3561_nIRQ: R40.1 TP5.1(TP) U7.17(~{IRQ}/MDAT)
SPI_SCK: R42.1
SPI_SDI: R43.1
SPI_SDO: R45.1
NetC30_2: C30.2 R37.1 U7.1(AVDD)
NetC31_1: C31.1 L4.1 R37.2
NetC32_2: C32.2 C62.1 R39.1 U7.20(DVDD)
NetC33_2: C33.2 U7.4(REFIN+/OUT)
NetR31_1: R31.1 R35.2 R38.2 U5.12(IN4+)
NetR32_1: R32.1 R36.2 U5.14(OUT4)
NetR32_2: R32.2 R33.1 R34.1 U5.13(IN4-)
NetR36_1: R36.1 R54.1 U7.6(CH1)
NetR41_2: R41.2 U7.13(~{CS})
NetR42_2: R42.2 U7.14(SCK)
NetR43_2: R43.2 U7.15(SDI)
NetR44_1: R44.1 R51.2 R55.2 U5.10(IN3+)
NetR45_2: R45.2 U7.16(SDO)
NetR47_1: R47.1 R52.2 U5.8(OUT3)
NetR47_2: R47.2 R48.1 R50.1 U5.9(IN3-)
NetR52_1: R52.1 R53.1 U7.5(CH0)

Not connected (* = marked no-connect by the designer): U5 6(~{SHDN}12)*

### Notes on the sheet
- Load Cell Acquisition
- Project:
- Title:
- Date:
- Sheet
- of
- Title
- Size:
- A3
- Revision:
- Design By:

### Library data of the parts
C30 C32 = CAP,Cer,100nF,25VDC,X7R,0402: as C3 on sheet Processor; HelpURL: https://search.murata.co.jp/Ceramy/image/img/A01X/G101/ENG/GRM155R71E104KE14-01.pdf; CreatedBy: Judd Foster
C31 C33 C62 = CAP,Cer,10uF,10VDC,X5R,0402: as C7 on sheet Processor; HelpURL: https://media.digikey.com/pdf/Data%20Sheets/Samsung%20PDFs/CL05A106MP5NUNC_Spec.pdf; CreatedBy: Judd Foster
L4 = IND,4.7uH,80mA,Multilayer,0805: 4.7 µH Shielded Multilayer Inductor 80 mA 300mOhm 0805 (2012 Metric); Vendor Part Number: 445-3169-1-ND; Manufacturer: TDK Corporation; Manufacturer Part Number: MLZ2012E4R7MT000; Vendor: Digikey; HelpURL: https://product.tdk.com/en/system/files?file=dam/doc/product/inductor/inductor/smd/catalog/inductor_commercial_decoupling_mlz2012_en.pdf; CreatedBy: Judd Foster
R31 R33 R34 R38 R44 R48 R50 R53-R55 = RES,1k,5%,0.063W,0402: as R10 on sheet USB_Serial; HelpURL: https://www.seielect.com/catalog/sei-rmcf_rmcp.pdf; CreatedBy: Judd Foster
R32 R47 = RES,300k,1%,0.063W,0402: 300 kOhms ±1% 0.063W, 1/16W Chip Resistor 0402 (1005 Metric) Automotive AEC-Q200 Thick Film; Manufacturer: Stackpole Electronics Inc; Manufacturer Part Number: RMCF0402FT300K; Vendor Part Number: RMCF0402FT300KCT-ND; Vendor: Digikey; CreatedBy: Judd Foster; HelpURL: https://www.seielect.com/catalog/sei-rmcf_rmcp.pdf
R35 R40 R51 = RES,10k,5%,0.063W,0402: as R1 on sheet Processor; HelpURL: https://www.seielect.com/catalog/sei-rmcf_rmcp.pdf; CreatedBy: Judd Foster
R36 R52 = RES,560R,1%,0.063W,0402: 560 Ohms ±1% 0.063W, 1/16W Chip Resistor 0402 (1005 Metric) Automotive AEC-Q200, Moisture Resistant Thick Film; Manufacturer: TE Connectivity Passive Product; Manufacturer Part Number: CRGCQ0402F560R; Vendor Part Number: A129624CT-ND; Vendor: Digikey; CreatedBy: Judd Foster; HelpURL: https://www.te.com/commerce/DocumentDelivery/DDEController?Action=srchrtrv&DocNm=1773204-3&DocType=DS&DocLang=English
R37 R39 R41-R43 R45 = RES,10R,1%,0.063W,0402: as R19 on sheet Load_Cell_Biasing; CreatedBy: Judd Foster; HelpURL: https://industrial.panasonic.com/cdbs/www-data/pdf/RDA0000/AOA0000C304.pdf
TP5 TP6 = TESTPOINT: PCB Testpoint; CreatedBy: Judd Foster; HelpURL: N/A; Manufacturer: N/A; Manufacturer Part Number: N/A; Vendor: N/A; Vendor Part Number: N/A
U5 = TLV9004SIRTER: as U5 on sheet Load_Cell_Biasing; CreatedBy: Judd Foster; HelpURL: https://www.ti.com/general/docs/suppproductinfo.tsp?distId=10&gotoUrl=https%3A%2F%2Fwww.ti.com%2Flit%2Fgpn%2Ftlv9004; Manufacturer Part Number: TLV9004SIRTER
U7 = MCP3561RT-E/ST: 24 Bit Analog to Digital Converter 1 Input 1 Sigma-Delta 20-TSSOP; Vendor Part Number: 150-MCP3561RT-E/STCT-ND; Manufacturer: Microchip Technology; Vendor: Digikey; Manufacturer Part Number: MCP3561RT-E/ST; HelpURL: https://ww1.microchip.com/downloads/en/DeviceDoc/MCP3561.2.4R-Data-Sheet-DS200006391A.pdf; CreatedBy: Judd Foster
NT1 = Net Tie: CreatedBy: Makan Mousavi; HelpURL: N/A; Manufacturer: N/A; Manufacturer Part Number: N/A; Vendor: N/A; Vendor Part Number: N/A

## Sheet Inertial_Measurement_RTC.SchDoc
size A3; Organization: Altium Limited; Address1: L3, 12a Rodborough Rd; Address2: Frenchs Forest; Address3: NSW; Address4: Australia 2086; DocumentNumber: 1; SheetNumber: 1; SheetTotal: 8
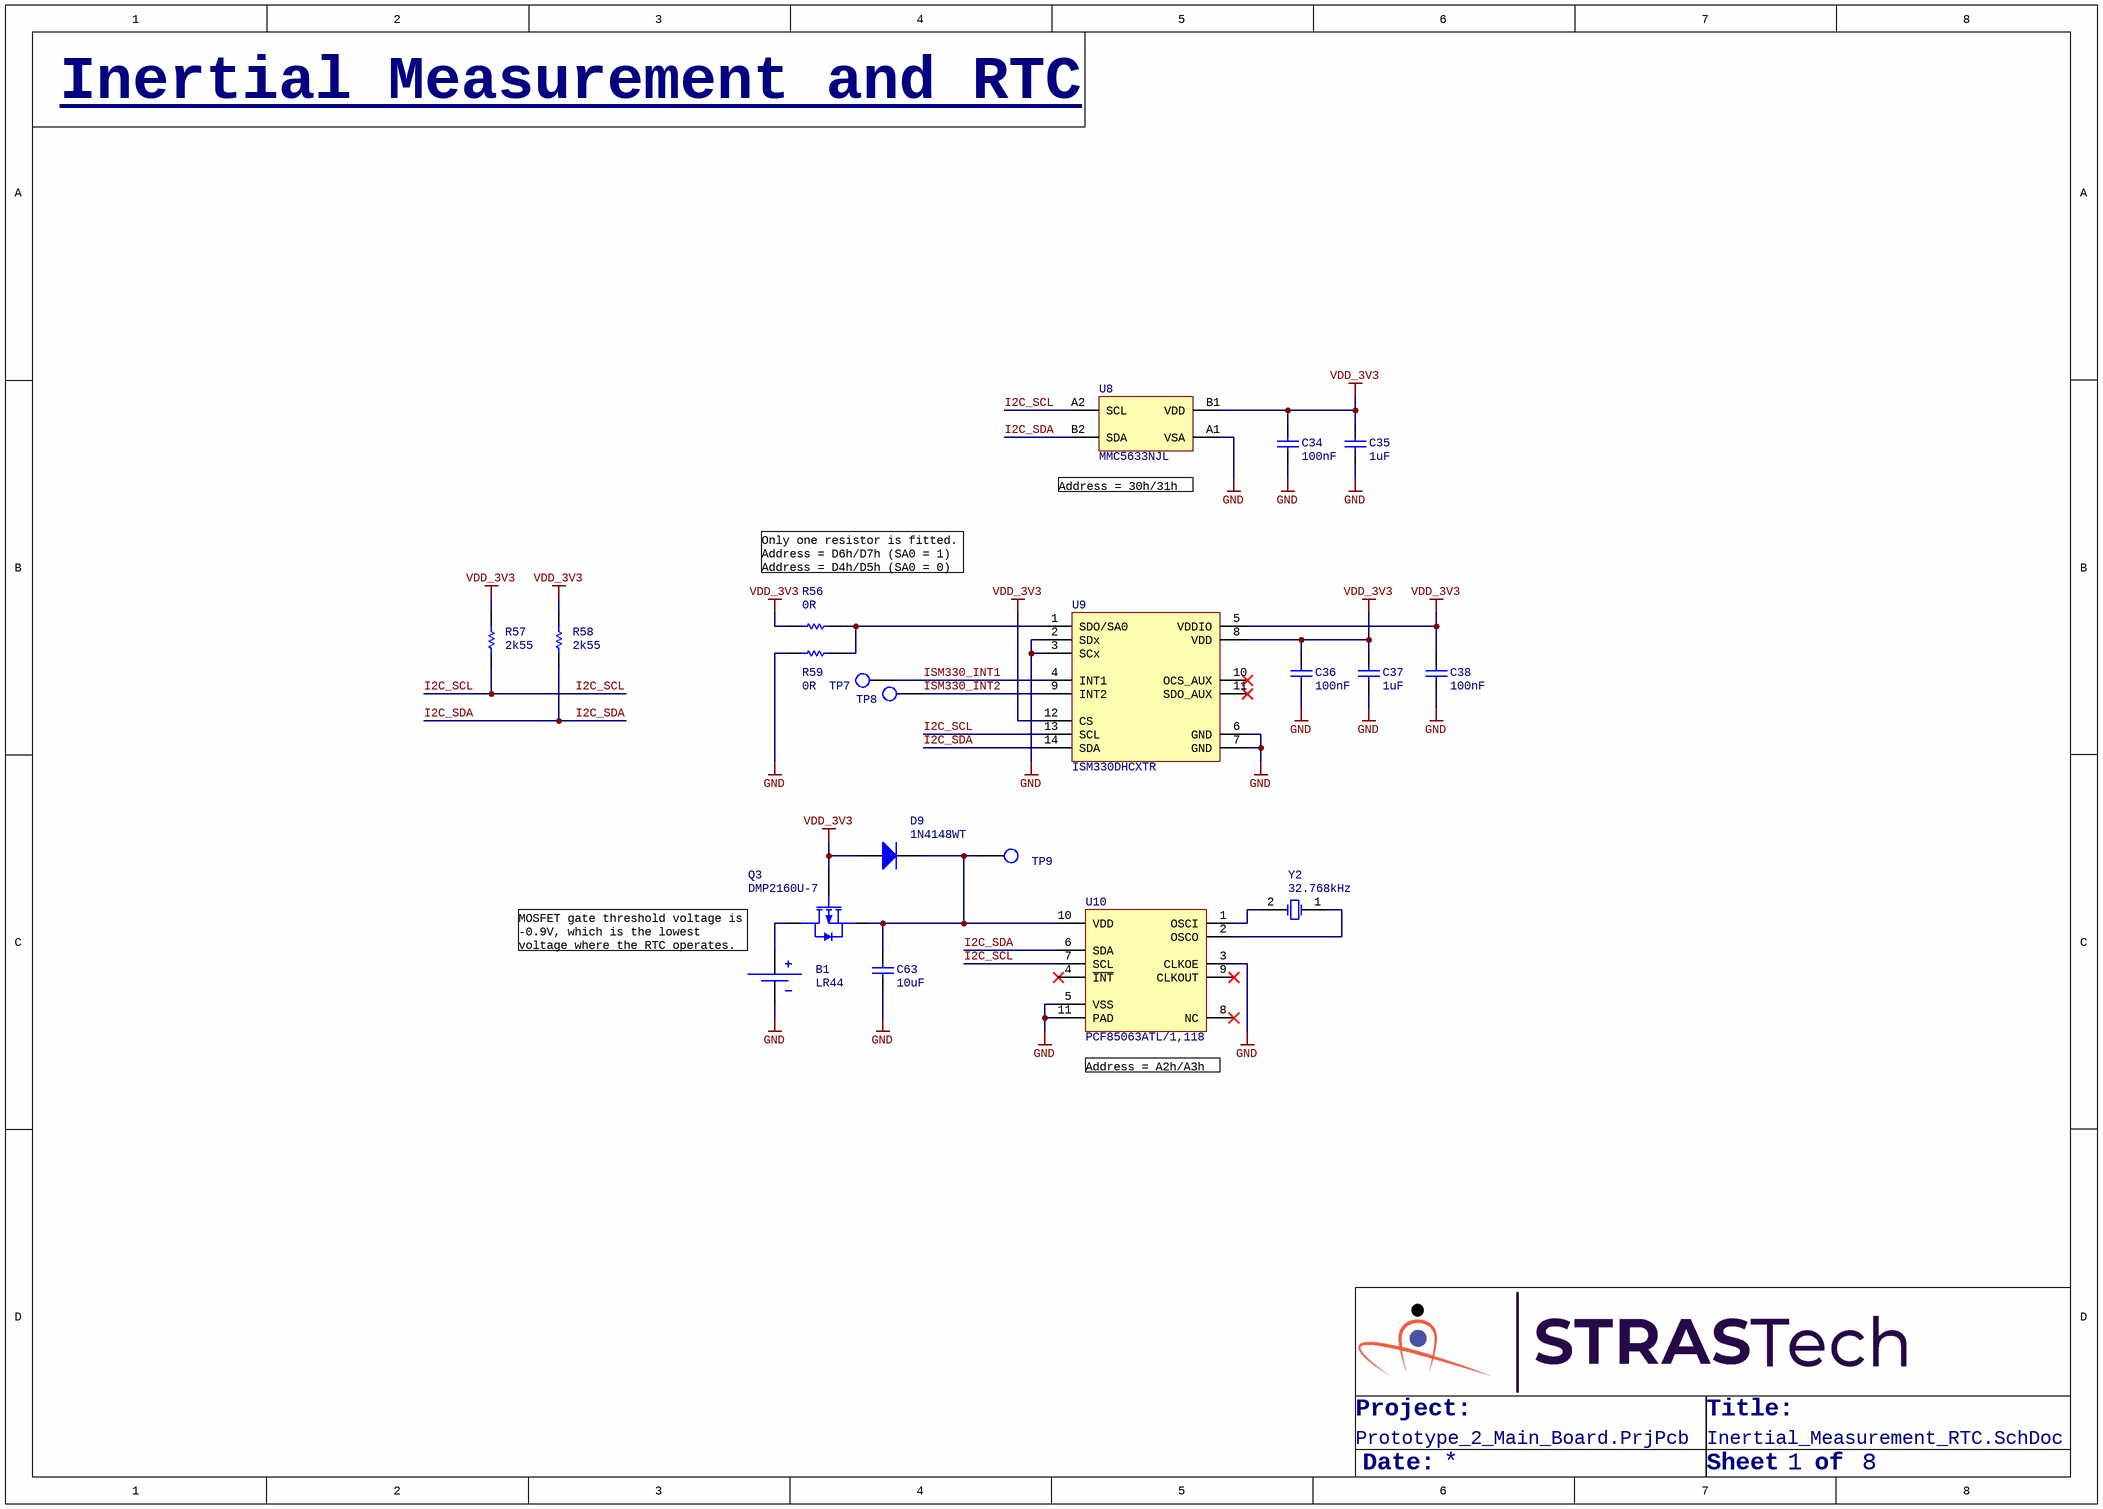
[diagram p4: Inertial_Measurement_RTC.SchDoc]

### Parts
B1  LR44  [Holder,Cell,LR44,PCB,Thru]
C34  100nF  [Cap,SMD,0402]
C35  1uF  [Cap,SMD,0402]
C36  100nF  [Cap,SMD,0402]
C37  1uF  [Cap,SMD,0402]
C38  100nF  [Cap,SMD,0402]
C63  10uF  [Cap,SMD,0402]
D9  1N4148WT  [SOD523]
Q3  DMP2160U-7  [SOT23-3]
R56  0R  [RES,0402]
R57  2k55  [RES,0402]
R58  2k55  [RES,0402]
R59  0R  [RES,0402]
TP7  TESTPOINT  [testpoint,smd,round,1mm]  (value not drawn)
TP8  TESTPOINT  [testpoint,smd,round,1mm]  (value not drawn)
TP9  TESTPOINT  [testpoint,smd,round,1mm]  (value not drawn)
U8  MMC5633NJL  [IC,WLP,2x2,P0.4mm]
U9  ISM330DHCXTR  [IC,LGA-14L,2.5x3mm]
U10  PCF85063ATL/1,118  [IC,DFN-10_3x3,P0.5mm]
Y2  32.768kHz  [XTAL,SMD,2PIN,2.0x1.2MM]

### Nets
GND: B1.2(BATT_N) C34.2 C35.1 C36.1 C37.1 C38.1 C63.2 R59.1 U8.A1(VSA) U9.2(SDx) U9.3(SCx) U9.6(GND) U9.7(GND) U10.3(CLKOE) U10.5(VSS) U10.11(PAD)
VDD_3V3: C34.1 C35.2 C36.2 C37.2 C38.2 D9.2(A) Q3.1(G) R56.1 R57.2 R58.2 U8.B1(VDD) U9.5(VDDIO) U9.8(VDD) U9.12(CS)
I2C_SCL: R57.1 U8.A2(SCL) U9.13(SCL) U10.7(SCL)
I2C_SDA: R58.1 U8.B2(SDA) U9.14(SDA) U10.6(SDA)
ISM330_INT1: TP7.1(TP) U9.4(INT1)
ISM330_INT2: TP8.1(TP) U9.9(INT2)
NetB1_1: B1.1(BATT_P) Q3.3(D)
NetC63_1: C63.1 D9.1(K) Q3.2(S) TP9.1(TP) U10.10(VDD)
NetR56_2: R56.2 R59.2 U9.1(SDO/SA0)
NetU10_1: U10.1(OSCI) Y2.2(GND)
NetU10_2: U10.2(OSCO) Y2.1(OSC1)

Not connected (* = marked no-connect by the designer): U9 10(OCS_AUX)* 11(SDO_AUX)*; U10 4(~{INT})* 8(NC)* 9(CLKOUT)*

### Notes on the sheet
- Inertial Measurement and RTC
- (near U8) Address = 30h/31h
- Only one resistor is fitted.
  Address = D6h/D7h (SA0 = 1)
  Address = D4h/D5h (SA0 = 0)
- MOSFET gate threshold voltage is -0.9V, which is the lowest voltage where the RTC operates.
- (near U10) Address = A2h/A3h
- Project:
- Title:
- Date:
- Sheet
- of
- Title
- Size:
- A3
- Revision:
- Design By:

### Library data of the parts
B1 = Holder,Cell,LR44,PCB,Thru: Battery Retainer Coin, 11.6mm 1 Cell PC Pin; Manufacturer: Keystone Electronics; Manufacturer Part Number: 2997; Vendor Part Number: 36-2997-ND; Vendor: Digikey; CreatedBy: Judd Foster; HelpURL: https://www.keyelco.com/userAssets/file/M65p7.pdf
C34 C36 C38 = CAP,Cer,100nF,25VDC,X7R,0402: as C3 on sheet Processor; HelpURL: https://search.murata.co.jp/Ceramy/image/img/A01X/G101/ENG/GRM155R71E104KE14-01.pdf; CreatedBy: Judd Foster
C35 C37 = CAP,Cer,1uF,35VDC,X5R,0402: as C5 on sheet Processor; HelpURL: https://product.tdk.com/info/en/catalog/datasheets/mlcc_commercial_general_en.pdf?ref_disty=digikey; CreatedBy: Judd Foster
C63 = CAP,Cer,10uF,10VDC,X5R,0402: as C7 on sheet Processor; HelpURL: https://media.digikey.com/pdf/Data%20Sheets/Samsung%20PDFs/CL05A106MP5NUNC_Spec.pdf; CreatedBy: Judd Foster
D9 = DIODE,Gen,75V,200mA,SOD523F: Diode Standard 75 V 200mA Surface Mount SOD-523F; Manufacturer: ON Semiconductor; Vendor Part Number: 1N4148WTCT-ND; Vendor: Digikey; CreatedBy: Judd Foster; HelpURL: https://rocelec.widen.net/view/pdf/bnxdzepaue/ONSM-S-A0003584797-1.pdf?t.download=true&u=5oefqw; Manufacturer Part Number: 1N4148WT
Q3 = MOSFET,P Ch,20V,3.2A: P-Channel 20 V 3.2A (Ta) 1.4W (Ta) Surface Mount SOT-23-3; Manufacturer: Diodes Incorporated; Vendor Part Number: DMP2160UDICT-ND; Vendor: Digikey; CreatedBy: Judd Foster; HelpURL: https://media.digikey.com/pdf/Data%20Sheets/Diodes%20PDFs/DMP2160U.pdf; Manufacturer Part Number: DMP2160U-7
R56 R59 = RES,0R0,0.1W,0402: as R11 on sheet USB_Serial; CreatedBy: Judd Foster; HelpURL: https://industrial.panasonic.com/cdbs/www-data/pdf/RDA0000/AOA0000C301.pdf
R57 R58 = RES,2k55,1%,0.063W,0402: 2.55 kOhms ±1% 0.063W, 1/16W Chip Resistor 0402 (1005 Metric) Automotive AEC-Q200 Thick Film; Manufacturer: Stackpole Electronics Inc; Manufacturer Part Number: RMCF0402FT2K55; Vendor Part Number: RMCF0402FT2K55CT-ND; Vendor: Digikey; CreatedBy: Judd Foster; HelpURL: https://www.seielect.com/catalog/sei-rmcf_rmcp.pdf
TP7-TP9 = TESTPOINT: PCB Testpoint; CreatedBy: Judd Foster; HelpURL: N/A; Manufacturer: N/A; Manufacturer Part Number: N/A; Vendor: N/A; Vendor Part Number: N/A
U8 = MMC5633NJL: Magnetoresistive Sensor X, Y, Z Axis 4-WLP (0.85x0.85); Manufacturer: Memsic Inc.; Vendor Part Number: 1267-MMC5633NJLCT-ND; Vendor: Digikey; CreatedBy: Judd Foster; HelpURL: https://media.digikey.com/pdf/Data%20Sheets/MEMSIC%20PDFs/MMC5633NJL_RevA_3-12-20.pdf; Manufacturer Part Number: MMC5633NJL
U9 = ISM330DHCXTR: Accelerometer, Gyroscope, Temperature, 6 Axis Sensor I²C, SPI Output; Manufacturer: STMicroelectronics; Vendor Part Number: 497-19784-1-ND; Vendor: Digikey; CreatedBy: Judd Foster; HelpURL: https://www.st.com/resource/en/datasheet/ism330dhcx.pdf; Manufacturer Part Number: ISM330DHCXTR
U10 = PCF85063ATL/1,118: Real Time Clock (RTC) IC Clock/Calendar - I²C, 2-Wire Serial 10-XFDFN Exposed Pad; Manufacturer: NXP USA Inc.; Vendor Part Number: 568-10235-1-ND; Vendor: Digikey; CreatedBy: Judd Foster; HelpURL: https://www.nxp.com/docs/en/data-sheet/PCF85063A.pdf; Manufacturer Part Number: PCF85063ATL/1,118
Y2 = XTAL,32.768kHz,9pF,SMD: 32.768 kHz ±20ppm Crystal 9pF 70 kOhms 2-SMD, No Lead; Manufacturer: Micro Crystal AG; Manufacturer Part Number: CM8V-T1A-32.768KHZ-9PF-20PPM-TA-QC; Vendor Part Number: 2195-CM8V-T1A-32.768KHZ-9PF-20PPM-TA-QCCT-ND; Vendor: Digikey; CreatedBy: Judd Foster; HelpURL: https://www.microcrystal.com/fileadmin/Media/Products/32kHz/Datasheet/CM8V-T1A.pdf

## Sheet Peripherals_Main_Board.SchDoc
size A3; Organization: Altium Limited; Address1: L3, 12a Rodborough Rd; Address2: Frenchs Forest; Address3: NSW; Address4: Australia 2086; DocumentNumber: 4; SheetNumber: 4; SheetTotal: 8
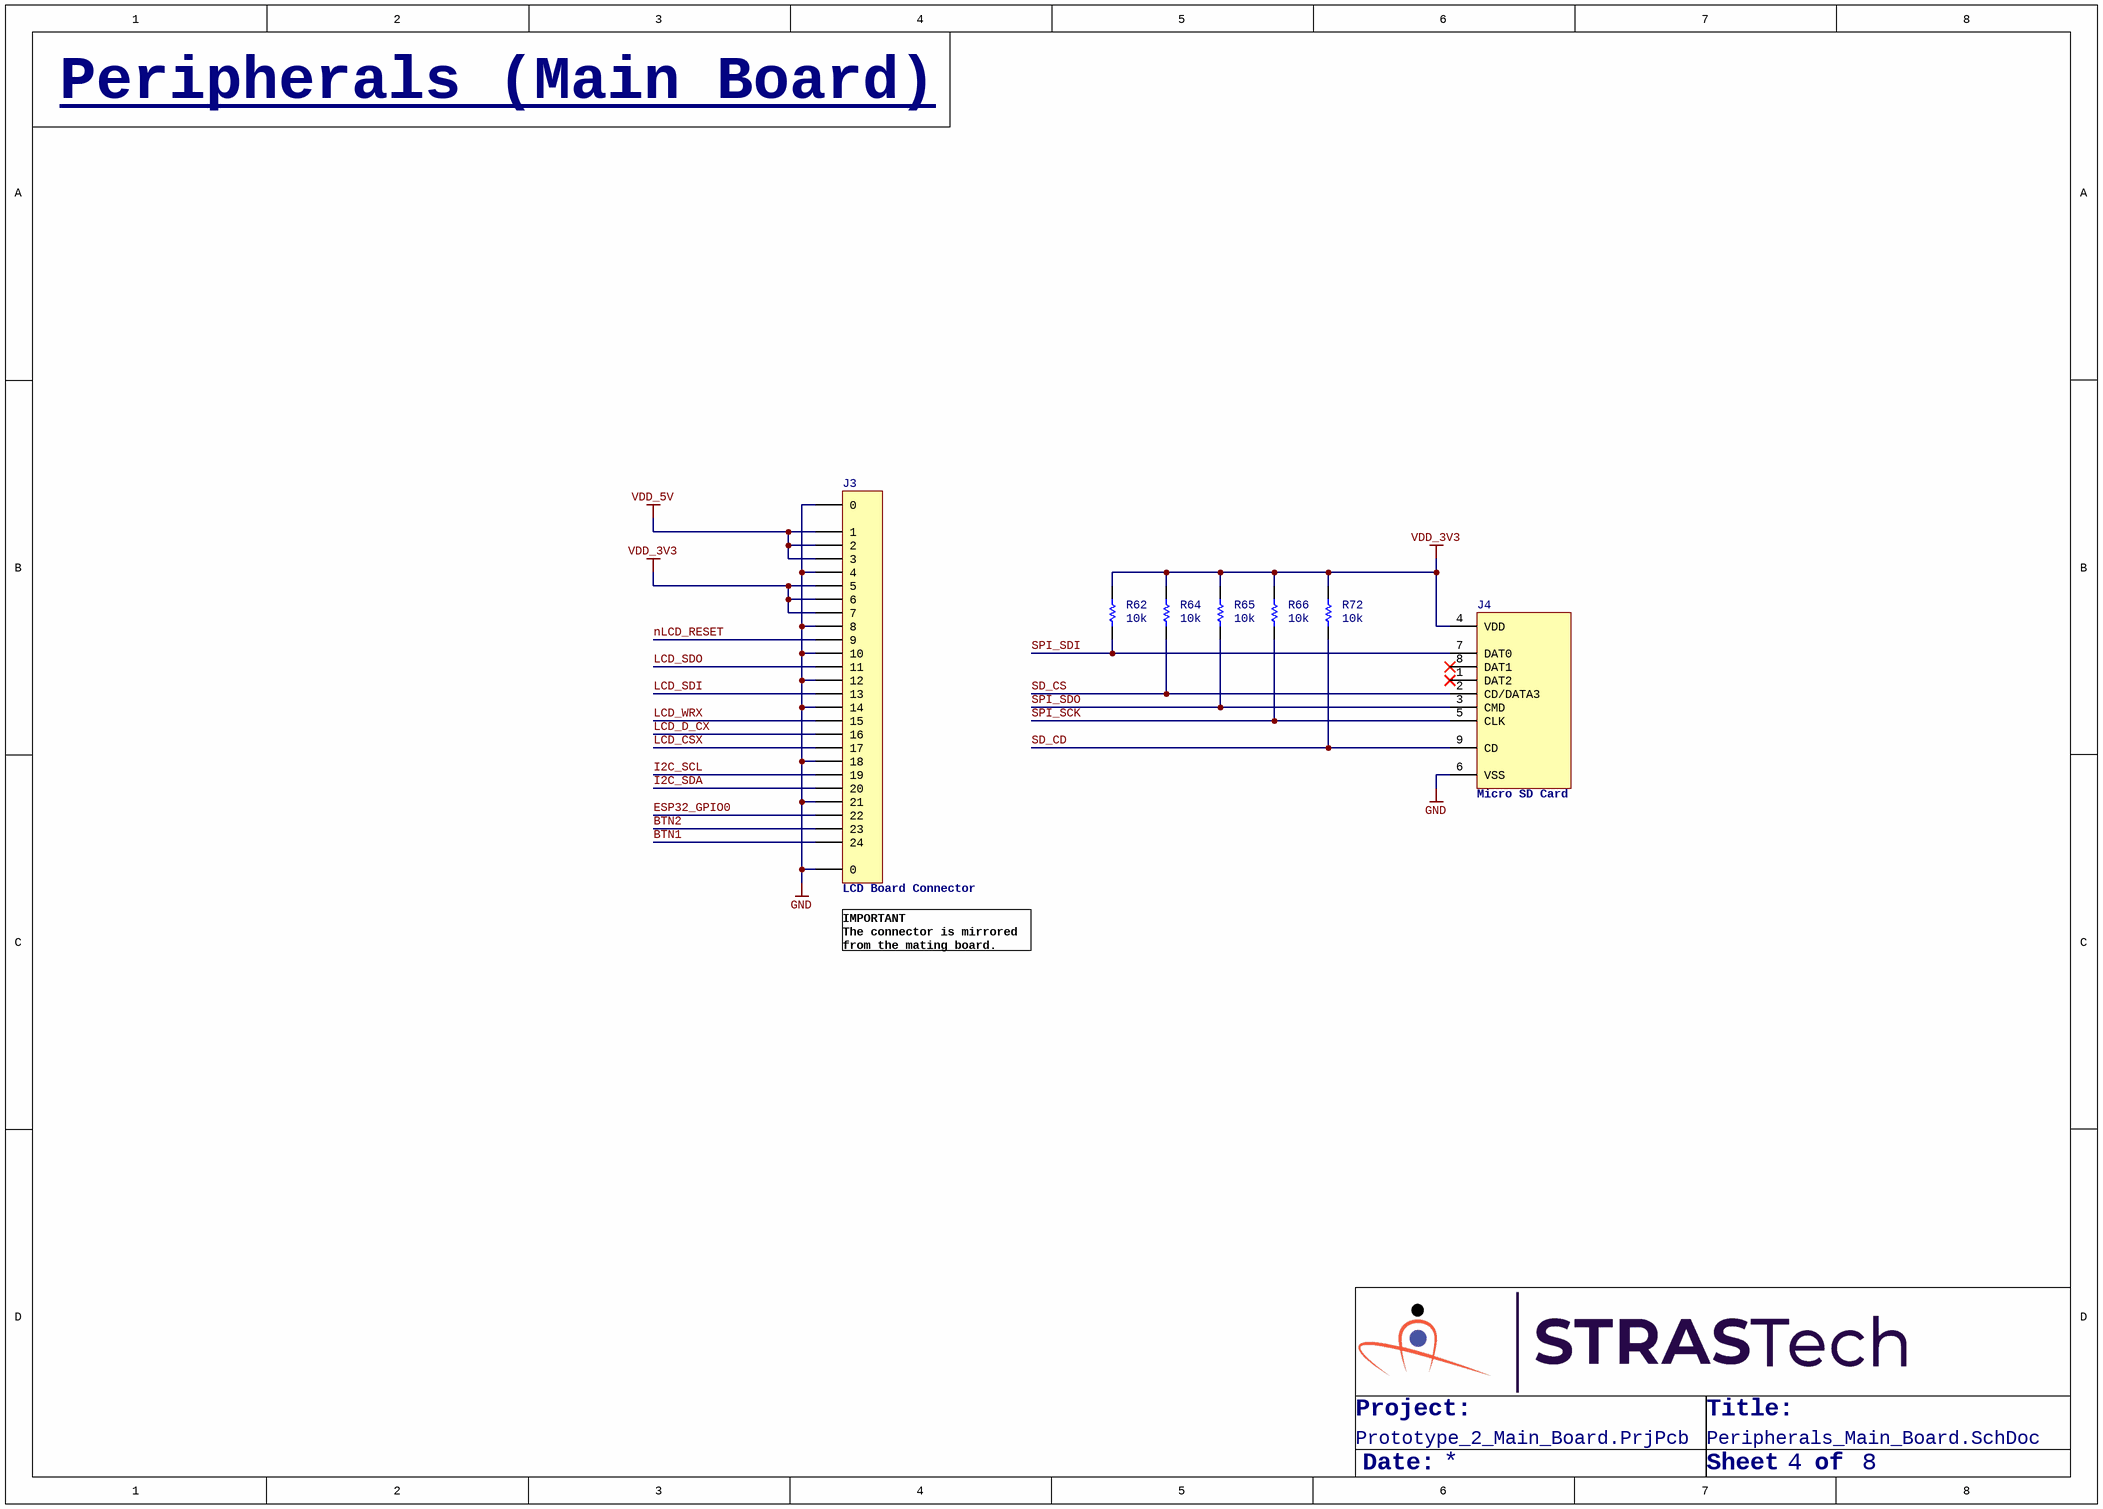
[diagram p5: Peripherals_Main_Board.SchDoc]

### Parts
J3  Conn,FFC,Bottom,24 Pin,0.5mm  [Conn,FFC,Bottom,24Pos,0.5mm]  (value not drawn)
J4  Micro SD Card  [Conn,MicroSD,Push-Push,SMD]  (value not drawn)
R62  10k  [RES,0402]
R64  10k  [RES,0402]
R65  10k  [RES,0402]
R66  10k  [RES,0402]
R72  10k  [RES,0402]

### Nets
GND: J3.0 J3.4 J3.8 J3.10 J3.12 J3.14 J3.18 J3.21 J4.6(VSS)
VDD_3V3: J3.5 J3.6 J3.7 J4.4(VDD) R62.2 R64.2 R65.2 R66.2 R72.2
VDD_5V: J3.1 J3.2 J3.3
BTN1: J3.24
BTN2: J3.23
ESP32_GPIO0: J3.22
I2C_SCL: J3.19
I2C_SDA: J3.20
LCD_CSX: J3.17
LCD_D_CX: J3.16
LCD_SDI: J3.13
LCD_SDO: J3.11
LCD_WRX: J3.15
nLCD_RESET: J3.9
SD_CD: J4.9(CD) R72.1
SD_CS: J4.2(CD/DATA3) R64.1
SPI_SCK: J4.5(CLK) R66.1
SPI_SDI: J4.7(DAT0) R62.1
SPI_SDO: J4.3(CMD) R65.1

Not connected (* = marked no-connect by the designer): J4 1(DAT2)* 8(DAT1)*

### Notes on the sheet
- Peripherals (Main Board)
- (near J4) Micro SD Card
- (near J3) LCD Board Connector
- (near J3) IMPORTANT
  The connector is mirrored from the mating board.
- Project:
- Title:
- Date:
- Sheet
- of
- Title
- Size:
- A3
- Revision:
- Design By:

### Library data of the parts
J3 = Conn,FFC,Bottom,24 Pin,0.5mm: 24 Position FFC, FPC Connector Contacts, Bottom 0.020" (0.50mm) Surface Mount, Right Angle; Vendor Part Number: 2057-PCA-6-LA-24-HL-3-ND; Manufacturer: Adam Tech; Manufacturer Part Number: PCA-6-LA-24-HL-3; Vendor: Digikey; HelpURL: https://app.adam-tech.com/products/download/data_sheet/198704/pca-6-la-xx-hl-3-data-sheet.pdf; Created By: Judd Foster
J4 = Conn,MicroSD,SMD,Push-Push: 9 (8 + 1) Position Card Connector Secure Digital - microSD™ Surface Mount, Right Angle Gold; Manufacturer: GCT; Manufacturer Part Number: MEM2075-00-140-01-A; Vendor Part Number: 2073-MEM2075-00-140-01-ACT-ND; Vendor: Digikey; CreatedBy: Judd Foster; HelpURL: https://gct.co/files/specs/MEM2075-SPEC.pdf
R62 R64-R66 R72 = RES,10k,5%,0.063W,0402: as R1 on sheet Processor; HelpURL: https://www.seielect.com/catalog/sei-rmcf_rmcp.pdf; CreatedBy: Judd Foster

## Sheet Regulation_Charging.SchDoc
size A3; Organization: Altium Limited; Address1: L3, 12a Rodborough Rd; Address2: Frenchs Forest; Address3: NSW; Address4: Australia 2086; DocumentNumber: 6; SheetNumber: 6; SheetTotal: 8
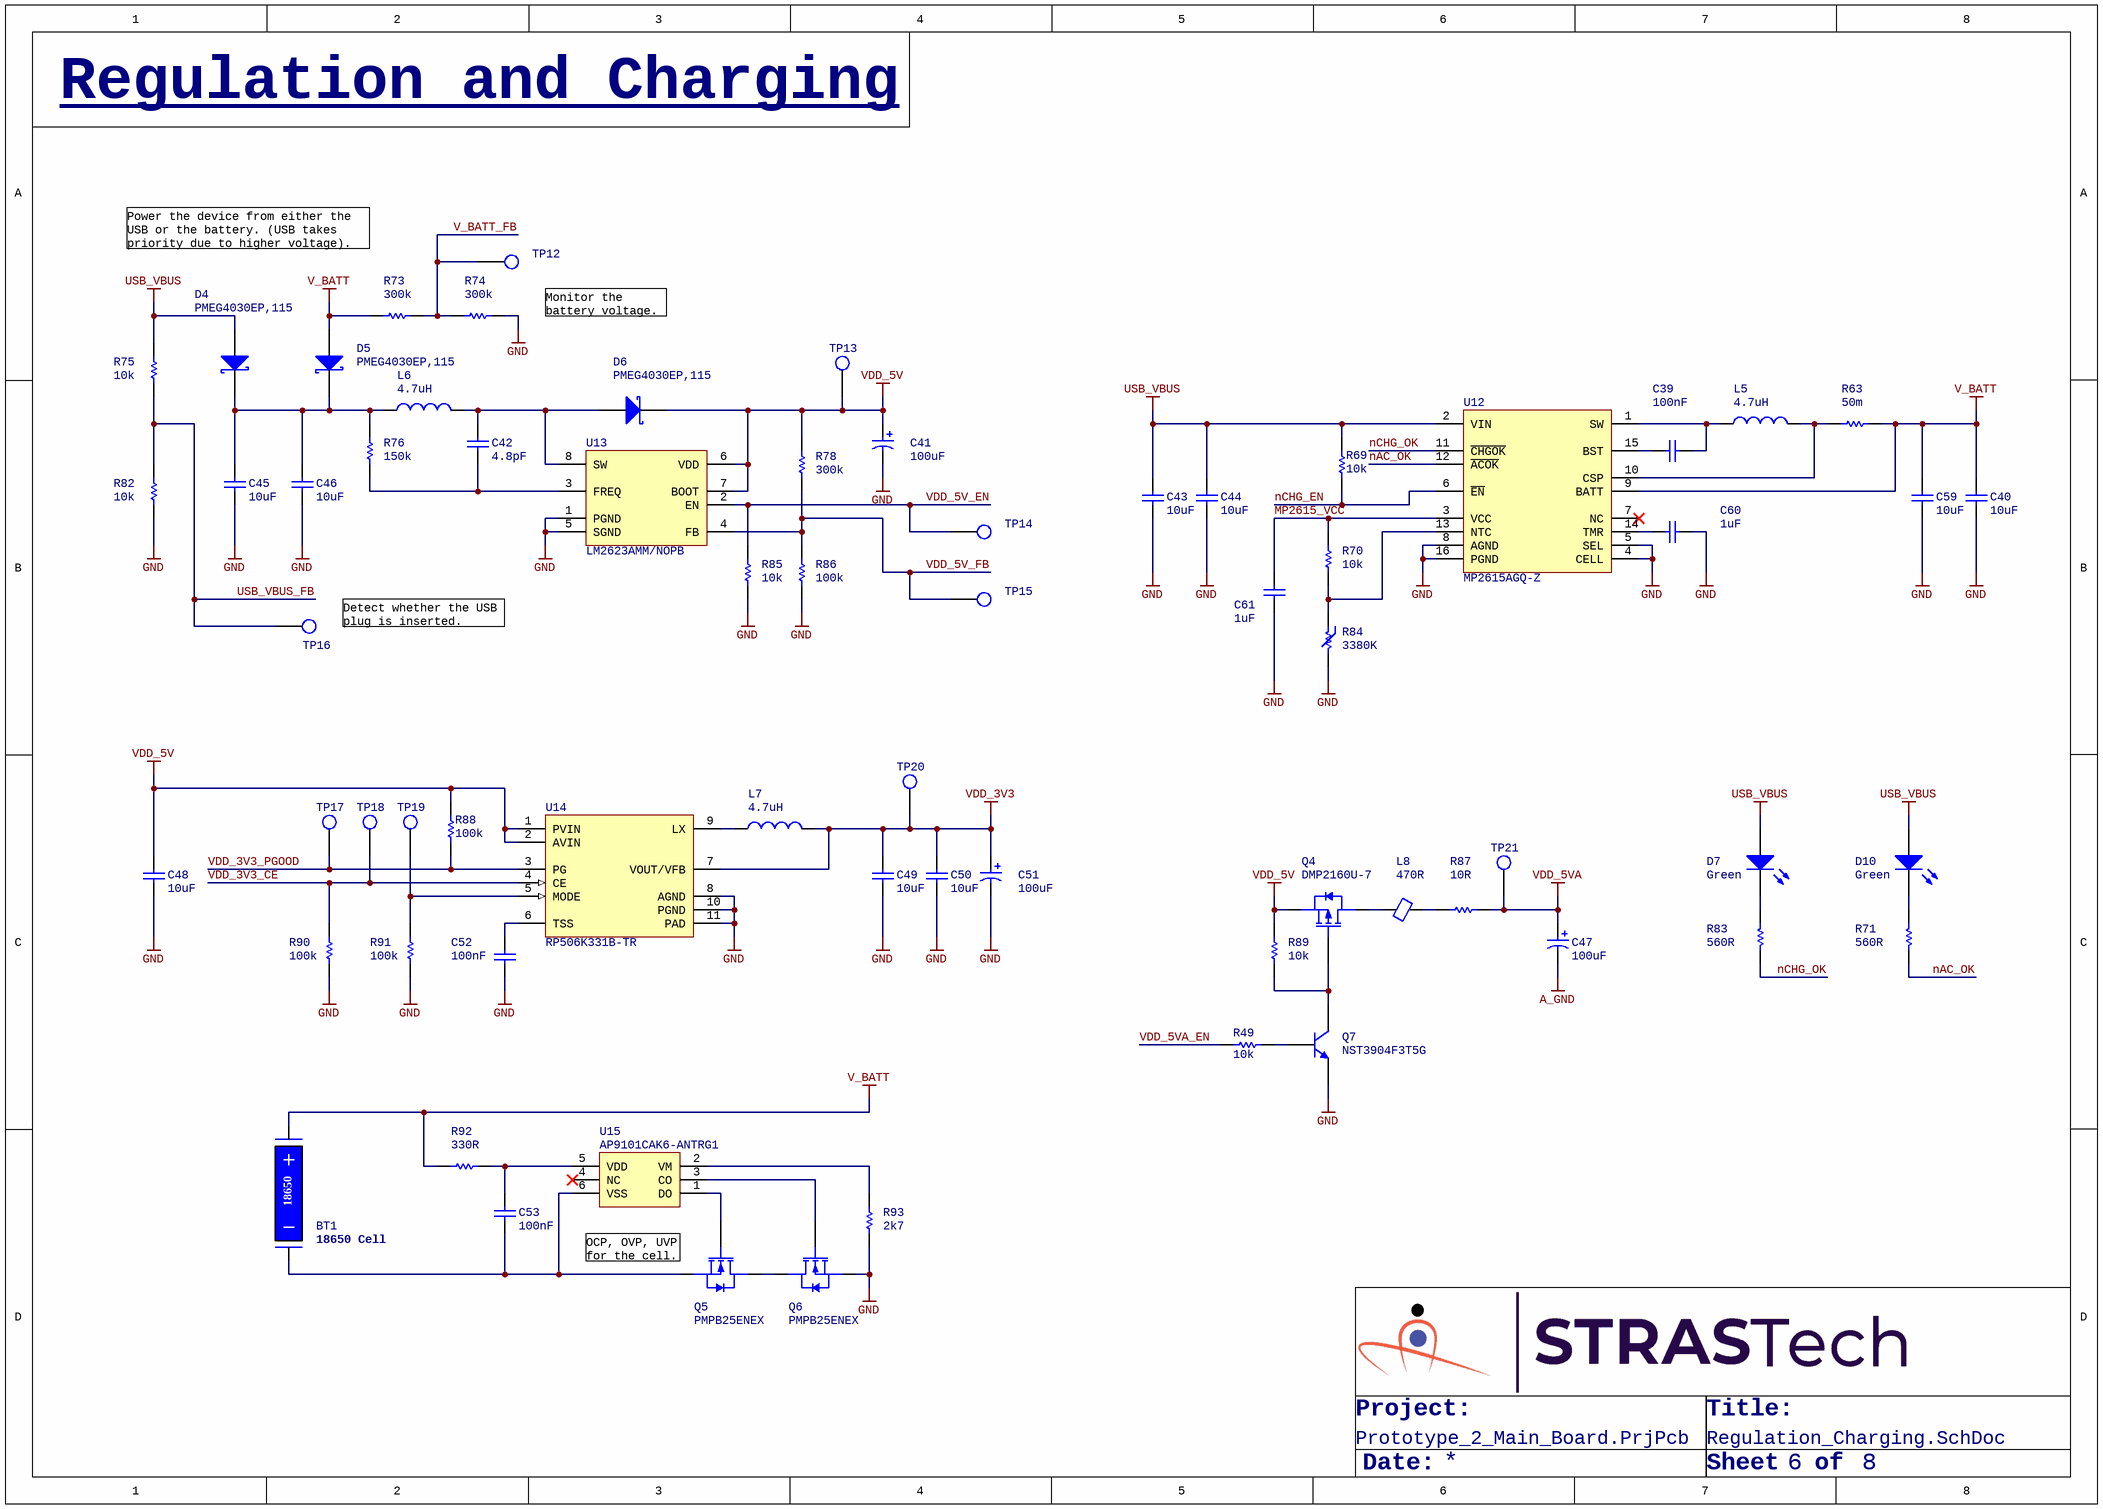
[diagram p6: Regulation_Charging.SchDoc]

### Parts
BT1  Holder,Cell,18650,SMD  [HOLDER,CELL,18650,SMD]  (value not drawn)
C39  100nF  [Cap,SMD,0402]
C40  10uF  [Cap,SMD,0402]
C41  100uF  [Cap,Alum,SMD,D5,H5.8]
C42  4.8pF  [Cap,SMD,0402]
C43  10uF  [Cap,SMD,0402]
C44  10uF  [Cap,SMD,0402]
C45  10uF  [Cap,SMD,0402]
C46  10uF  [Cap,SMD,0402]
C47  100uF  [Cap,Alum,SMD,D5,H5.8]
C48  10uF  [Cap,SMD,0402]
C49  10uF  [Cap,SMD,0402]
C50  10uF  [Cap,SMD,0402]
C51  100uF  [Cap,Alum,SMD,D5,H5.8]
C52  100nF  [Cap,SMD,0402]
C53  100nF  [Cap,SMD,0402]
C59  10uF  [Cap,SMD,0402]
C60  1uF  [Cap,SMD,0402]
C61  1uF  [Cap,SMD,0402]
D4  PMEG4030EP,115  [SOD128]
D5  PMEG4030EP,115  [SOD128]
D6  PMEG4030EP,115  [SOD128]
D7  Green  [LED,0603]
D10  Green  [LED,0603]
L5  4.7uH  [IND,WIREWOUND,4.9x4.9,SMD]
L6  4.7uH  [IND,WIREWOUND,4.9x4.9,SMD]
L7  4.7uH  [IND,WIREWOUND,4.9x4.9,SMD]
L8  470R  [IND,0402]
Q4  DMP2160U-7  [SOT23-3]
Q5  PMPB25ENEX  [IC,WDFN-6,P0.65]
Q6  PMPB25ENEX  [IC,WDFN-6,P0.65]
Q7  NST3904F3T5G  [SOT1123]
R49  10k  [RES,0402]
R63  50m  [RES,1206]
R69  10k  [RES,0402]
R70  10k  [RES,0402]
R71  560R  [RES,0402]
R73  300k  [RES,0402]
R74  300k  [RES,0402]
R75  10k  [RES,0402]
R76  150k  [RES,0402]
R78  300k  [RES,0402]
R82  10k  [RES,0402]
R83  560R  [RES,0402]
R84  3380K  [RES,0402]
R85  10k  [RES,0402]
R86  100k  [RES,0402]
R87  10R  [RES,0402]
R88  100k  [RES,0402]
R89  10k  [RES,0402]
R90  100k  [RES,0402]
R91  100k  [RES,0402]
R92  330R  [RES,0402]
R93  2k7  [RES,0402]
TP12  TESTPOINT  [testpoint,smd,round,1mm]  (value not drawn)
TP13  TESTPOINT  [testpoint,smd,round,1mm]  (value not drawn)
TP14  TESTPOINT  [testpoint,smd,round,1mm]  (value not drawn)
TP15  TESTPOINT  [testpoint,smd,round,1mm]  (value not drawn)
TP16  TESTPOINT  [testpoint,smd,round,1mm]  (value not drawn)
TP17  TESTPOINT  [testpoint,smd,round,1mm]  (value not drawn)
TP18  TESTPOINT  [testpoint,smd,round,1mm]  (value not drawn)
TP19  TESTPOINT  [testpoint,smd,round,1mm]  (value not drawn)
TP20  TESTPOINT  [testpoint,smd,round,1mm]  (value not drawn)
TP21  TESTPOINT  [testpoint,smd,round,1mm]  (value not drawn)
U12  MP2615AGQ-Z  [IC,QFN-16,3x3,P5x3]
U13  LM2623AMM/NOPB  [IC,TSSOP-8,W3.0]
U14  RP506K331B-TR  [IC,DFN-10_3x3,P0.5mm]
U15  AP9101CAK6-ANTRG1  [SOT23-6]

### Nets
A_GND: C47.2
GND: C40.1 C41.2 C43.1 C44.1 C45.1 C46.1 C48.1 C49.1 C50.1 C51.2 C52.1 C59.1 C60.2 C61.1 Q6.3(S) Q7.2(E) R74.1 R82.1 R84.2 R85.1 R86.1 R90.1 R91.2 R93.1 U12.4(CELL) U12.5(SEL) U12.8(AGND) U12.16(PGND) U13.1(PGND) U13.5(SGND) U14.8(AGND) U14.10(PGND) U14.11(PAD)
USB_VBUS: C43.2 C44.2 D4.2(A) D7.1(A) D10.1(A) R69.1 R75.2 U12.2(VIN)
V_BATT: BT1.1 C40.2 C59.2 D5.2(A) R63.2 R73.2 R92.1 U12.9(BATT)
VDD_3V3: C49.2 C50.2 C51.1 L7.2 TP20.1(TP) U14.7(VOUT/VFB)
VDD_5V: C41.1 C48.2 D6.1(K) Q4.2(S) R78.2 R88.2 R89.2 TP13.1(TP) U13.6(VDD) U13.7(BOOT) U14.1(PVIN) U14.2(AVIN)
VDD_5VA: C47.1 R87.2 TP21.1(TP)
MP2615_VCC: C61.2 R70.1 U12.3(VCC)
nAC_OK: R71.2 U12.12(~{ACOK})
nCHG_EN: R69.2 U12.6(~{EN})
nCHG_OK: R83.2 U12.11(~{CHGOK})
USB_VBUS_FB: R75.1 R82.2 TP16.1(TP)
V_BATT_FB: R73.1 R74.2 TP12.1(TP)
VDD_3V3_CE: R90.2 TP18.1(TP) U14.4(CE)
VDD_3V3_PGOOD: R88.1 TP17.1(TP) U14.3(PG)
VDD_5V_EN: R85.2 TP14.1(TP) U13.2(EN)
VDD_5V_FB: R78.1 R86.2 TP15.1(TP) U13.4(FB)
VDD_5VA_EN: R49.2
NetBT1_2: BT1.2 C53.1 Q5.3(S) U15.6(VSS)
NetC39_1: C39.1 L5.1 U12.1(SW)
NetC39_2: C39.2 U12.15(BST)
NetC42_1: C42.1 R76.1 U13.3(FREQ)
NetC42_2: C42.2 D6.2(A) L6.2 U13.8(SW)
NetC45_2: C45.2 C46.2 D4.1(K) D5.1(K) L6.1 R76.2
NetC52_2: C52.2 U14.6(TSS)
NetC53_2: C53.2 R92.2 U15.5(VDD)
NetC60_1: C60.1 U12.14(TMR)
NetD7_2: D7.2(K) R83.1
NetD10_2: D10.2(K) R71.1
NetL5_2: L5.2 R63.1 U12.10(CSP)
NetL7_1: L7.1 U14.9(LX)
NetL8_1: L8.1 Q4.3(D)
NetL8_2: L8.2 R87.1
NetQ4_1: Q4.1(G) Q7.3(C) R89.1
NetQ5_1: Q5.1(D) Q6.1(D)
NetQ5_2: Q5.2(G) U15.1(DO)
NetQ6_2: Q6.2(G) U15.3(CO)
NetQ7_1: Q7.1(B) R49.1
NetR70_2: R70.2 R84.1 U12.13(NTC)
NetR91_1: R91.1 TP19.1(TP) U14.5(MODE)
NetR93_2: R93.2 U15.2(VM)

Not connected (* = marked no-connect by the designer): U12 7(NC)*; U15 4(NC)*

### Notes on the sheet
- Regulation and Charging
- Power the device from either the USB or the battery. (USB takes priority due to higher voltage).
- Monitor the battery voltage.
- (near TP16) Detect whether the USB plug is inserted.
- (near BT1) 18650 Cell
- (near Q5) OCP, OVP, UVP for the cell.
- Project:
- Title:
- Date:
- Sheet
- of
- Title
- Size:
- A3
- Revision:
- Design By:
- (in symbol Holder,Cell,18650,SMD) 18650

### Library data of the parts
BT1 = Holder,Cell,18650,SMD: Battery Holder (Open) 18650 1 Cell SMD (SMT) Tab; Manufacturer: Keystone Electronics; Manufacturer Part Number: 1042; Vendor Part Number: 36-1042-ND; Vendor: Digikey; HelpURL: https://www.keyelco.com/userAssets/file/M65p27.pdf; CreatedBy: Judd Foster
C39 C52 C53 = CAP,Cer,100nF,25VDC,X7R,0402: as C3 on sheet Processor; HelpURL: https://search.murata.co.jp/Ceramy/image/img/A01X/G101/ENG/GRM155R71E104KE14-01.pdf; CreatedBy: Judd Foster
C40 C43-C46 C48-C50 C59 = CAP,Cer,10uF,10VDC,X5R,0402: as C7 on sheet Processor; HelpURL: https://media.digikey.com/pdf/Data%20Sheets/Samsung%20PDFs/CL05A106MP5NUNC_Spec.pdf; CreatedBy: Judd Foster
C41 C47 C51 = CAP,Alum,100uF,10VDC,SMD: CAP ALUM 100UF 20% 10V SMD; Vendor Part Number: PCE3867CT-ND; Manufacturer: Panasonic; Manufacturer Part Number: EEE-1AA101WR; Vendor: Digikey; HelpURL: https://media.digikey.com/pdf/Data%20Sheets/Panasonic%20Electronic%20Components/S_Series,Type_V_Rev2018.pdf; CreatedBy: Judd Foster
C42 = CAP,Cer,4.8pF,50VDC,C0G/NP0,0402: as C1 on sheet Processor; HelpURL: https://search.murata.co.jp/Ceramy/image/img/A01X/G101/ENG/GCQ1555C1H4R8CB01-01.pdf; CreatedBy: Judd Foster
C60 C61 = CAP,Cer,1uF,35VDC,X5R,0402: as C5 on sheet Processor; HelpURL: https://product.tdk.com/info/en/catalog/datasheets/mlcc_commercial_general_en.pdf?ref_disty=digikey; CreatedBy: Judd Foster
D4-D6 = DIODE,Schottky,40V,3A,SMD: Diode Schottky 40V 3A Surface Mount CFP5; Manufacturer: Nexperia USA Inc.; Vendor Part Number: 1727-5841-1-ND; Vendor: Digikey; CreatedBy: Judd Foster; HelpURL: https://assets.nexperia.com/documents/data-sheet/PMEG4030EP.pdf; Manufacturer Part Number: PMEG4030EP,115
D7 D10 = LED,Green,SMD,0603: as D1 on sheet Processor; CreatedBy: Judd Foster; HelpURL: http://www.stanley-components.com/php/downloaddatafile.php?rp=0,THG1111C-0005_e.pdf
L5-L7 = IND,4.7uH,2.6A,Wirewound,SMD: 4.7µH Shielded Wirewound Inductor 2.6A 45.5mOhm Max Nonstandard; Vendor Part Number: 587-3605-1-ND; Manufacturer: Taiyo Yuden; Manufacturer Part Number: NRS5030T4R7MMGJV; Vendor: Digikey; HelpURL: https://ds.yuden.co.jp/TYCOMPAS/ut/detail?pn=NRS5030T4R7MMGJV%20%20&u=M; CreatedBy: Judd Foster
L8 = Ferrite,470R@100MHz,0402: as L3 on sheet USB_Serial; HelpURL: https://www.murata.com/en-us/products/productdata/8796740059166/ENFA0018.pdf; CreatedBy: Judd Foster
Q4 = MOSFET,P Ch,20V,3.2A: as Q3 on sheet Inertial_Measurement_RTC; CreatedBy: Judd Foster; HelpURL: https://media.digikey.com/pdf/Data%20Sheets/Diodes%20PDFs/DMP2160U.pdf; Manufacturer Part Number: DMP2160U-7
Q5 Q6 = MOSFET,N Ch,30V,10A: N-Channel 30 V 10A (Ta) 2.1W (Ta) Surface Mount DFN2020MD-6; Manufacturer: Nexperia USA Inc.; Vendor Part Number: 1727-7662-1-ND; Vendor: Digikey; CreatedBy: Ritesh Nandakumar; HelpURL: https://assets.nexperia.com/documents/data-sheet/PMPB25ENE.pdf; Manufacturer Part Number: PMPB25ENEX
Q7 = Trans,NPN,40V,200mA,SOT1123: as Q1 on sheet USB_Serial; CreatedBy: Judd Foster; HelpURL: https://www.onsemi.com/pdf/datasheet/nst3904f3-d.pdf; Manufacturer Part Number: NST3904F3T5G
R49 R69 R70 R75 R82 R85 R89 = RES,10k,5%,0.063W,0402: as R1 on sheet Processor; HelpURL: https://www.seielect.com/catalog/sei-rmcf_rmcp.pdf; CreatedBy: Judd Foster
R63 = RES,50m,1%,0.5W,1206: 50 mOhms ±1% 0.5W, 1/2W Chip Resistor 1206 (3216 Metric) Current Sense Metal Film; Manufacturer: Ohmite; Manufacturer Part Number: KDV12FR050ET; Vendor Part Number: 273-KDV12FR050ETCT-ND; Vendor: Digikey; CreatedBy: Judd Foster; HelpURL: https://www.ohmite.com/assets/docs/res_kdv.pdf?r=false
R71 R83 = RES,560R,1%,0.063W,0402: as R36 on sheet Load_Cell_Acquisition; CreatedBy: Judd Foster; HelpURL: https://www.te.com/commerce/DocumentDelivery/DDEController?Action=srchrtrv&DocNm=1773204-3&DocType=DS&DocLang=English
R73 R74 R78 = RES,300k,1%,0.063W,0402: as R32 on sheet Load_Cell_Acquisition; CreatedBy: Judd Foster; HelpURL: https://www.seielect.com/catalog/sei-rmcf_rmcp.pdf
R76 = RES,150k,1%,0.1W,0402: 150 kOhms ±1% 0.063W, 1/16W Chip Resistor 0402 (1005 Metric) Automotive AEC-Q200 Thick Film; Manufacturer: Stackpole Electronics Inc; Manufacturer Part Number: RMCF0402FT150K; Vendor Part Number: RMCF0402FT150KCT-ND; Vendor: Digikey; CreatedBy: Judd Foster; HelpURL: https://www.seielect.com/catalog/sei-rmcf_rmcp.pdf
R84 = RES,Thermistor,3380K,0402: NTC Thermistor 10k 0402 (1005 Metric); Manufacturer: Murata Electronics; Manufacturer Part Number: NCU15XH103J6SRC; Vendor Part Number: 490-NCU15XH103J6SRCCT-ND; Vendor: Digikey; CreatedBy: Judd Foster; HelpURL: https://www.murata.com/en-us/api/pdfdownloadapi?cate=luNTCforTempeSenso&partno=NCU15XH103J6SRC
R86 R88 R90 R91 = RES,100k,5%,0.1W,0402: 100 kOhms ±5% 0.1W, 1/10W Chip Resistor 0402 (1005 Metric) Automotive AEC-Q200 Thick Film; Manufacturer: Panasonic Electronic Components; Manufacturer Part Number: ERJ-2GEJ104X; Vendor Part Number: P100KJCT-ND; Vendor: Digikey; CreatedBy: Judd Foster; HelpURL: https://b2b-api.panasonic.eu/file_stream/pids/fileversion/1242
R87 = RES,10R,1%,0.063W,0402: as R19 on sheet Load_Cell_Biasing; CreatedBy: Judd Foster; HelpURL: https://industrial.panasonic.com/cdbs/www-data/pdf/RDA0000/AOA0000C304.pdf
R92 = RES,330R,5%,0.063W,0402: as R5 on sheet Processor; CreatedBy: Judd Foster; HelpURL: https://www.seielect.com/catalog/sei-rmcf_rmcp.pdf
R93 = RES,2k7,1%,0.063W,0402: 2.7 kOhms ±1% 0.063W, 1/16W Chip Resistor 0402 (1005 Metric) Automotive AEC-Q200 Thick Film; Manufacturer: Stackpole Electronics Inc; Manufacturer Part Number: RMCF0402FT2K70; Vendor Part Number: RMCF0402FT2K70CT-ND; Vendor: Digikey; CreatedBy: Judd Foster; HelpURL: https://www.seielect.com/catalog/sei-rmcf_rmcp.pdf
TP12-TP21 = TESTPOINT: PCB Testpoint; CreatedBy: Judd Foster; HelpURL: N/A; Manufacturer: N/A; Manufacturer Part Number: N/A; Vendor: N/A; Vendor Part Number: N/A
U12 = MP2615AGQ-Z: Charger IC Lithium Ion/Polymer 16-QFN (3x3); Manufacturer: Monolithic Power Systems Inc.; Vendor Part Number: 1589-MP2615AGQ-ZCT-ND; Vendor: Digikey; CreatedBy: Judd Foster; HelpURL: https://www.monolithicpower.com/en/documentview/productdocument/index/version/2/document_type/Datasheet/lang/en/sku/MP2615AGQ-Z/document_id/1433/; Manufacturer Part Number: MP2615AGQ-Z
U13 = LM2623AMM/NOPB: Boost Switching Regulator IC Positive Adjustable 1.24V 1 Output 2.2A (Switch) 8-TSSOP, 8-MSOP (0.118", 3.00mm Width); Vendor Part Number: LM2623AMM/NOPBCT-ND; Manufacturer: Texas Instruments; Vendor: Digikey; Manufacturer Part Number: LM2623AMM/NOPB; HelpURL: https://www.ti.com/general/docs/suppproductinfo.tsp?distId=10&gotoUrl=https%3A%2F%2Fwww.ti.com%2Flit%2Fgpn%2Flm2623; CreatedBy: Judd Foster
U14 = RP506K331B-TR: Buck Switching Regulator IC Positive Fixed 3.3V 1 Output 2A 10-UFDFN Exposed Pad; Manufacturer: Nisshinbo Micro Devices Inc.; Vendor Part Number: 2129-RP506K331B-CT-ND; Vendor: Digikey; CreatedBy: Judd Foster; HelpURL: https://www.nisshinbo-microdevices.co.jp/en/pdf/datasheet/rp506-ea.pdf; Manufacturer Part Number: RP506K331B-TR
U15 = AP9101CAK6-ANTRG1: Battery Battery Protection IC Lithium Ion/Polymer SOT-26; Manufacturer: Diodes Incorporated; Vendor Part Number: AP9101CAK6-ANTRG1DICT-ND; Vendor: Digikey; CreatedBy: Judd Foster; HelpURL: https://www.diodes.com/assets/Datasheets/AP9101C.pdf; Manufacturer Part Number: AP9101CAK6-ANTRG1